# Altium project ESP32_INDUSTRIAL_IO.PrjPcb (part 1 of 2)
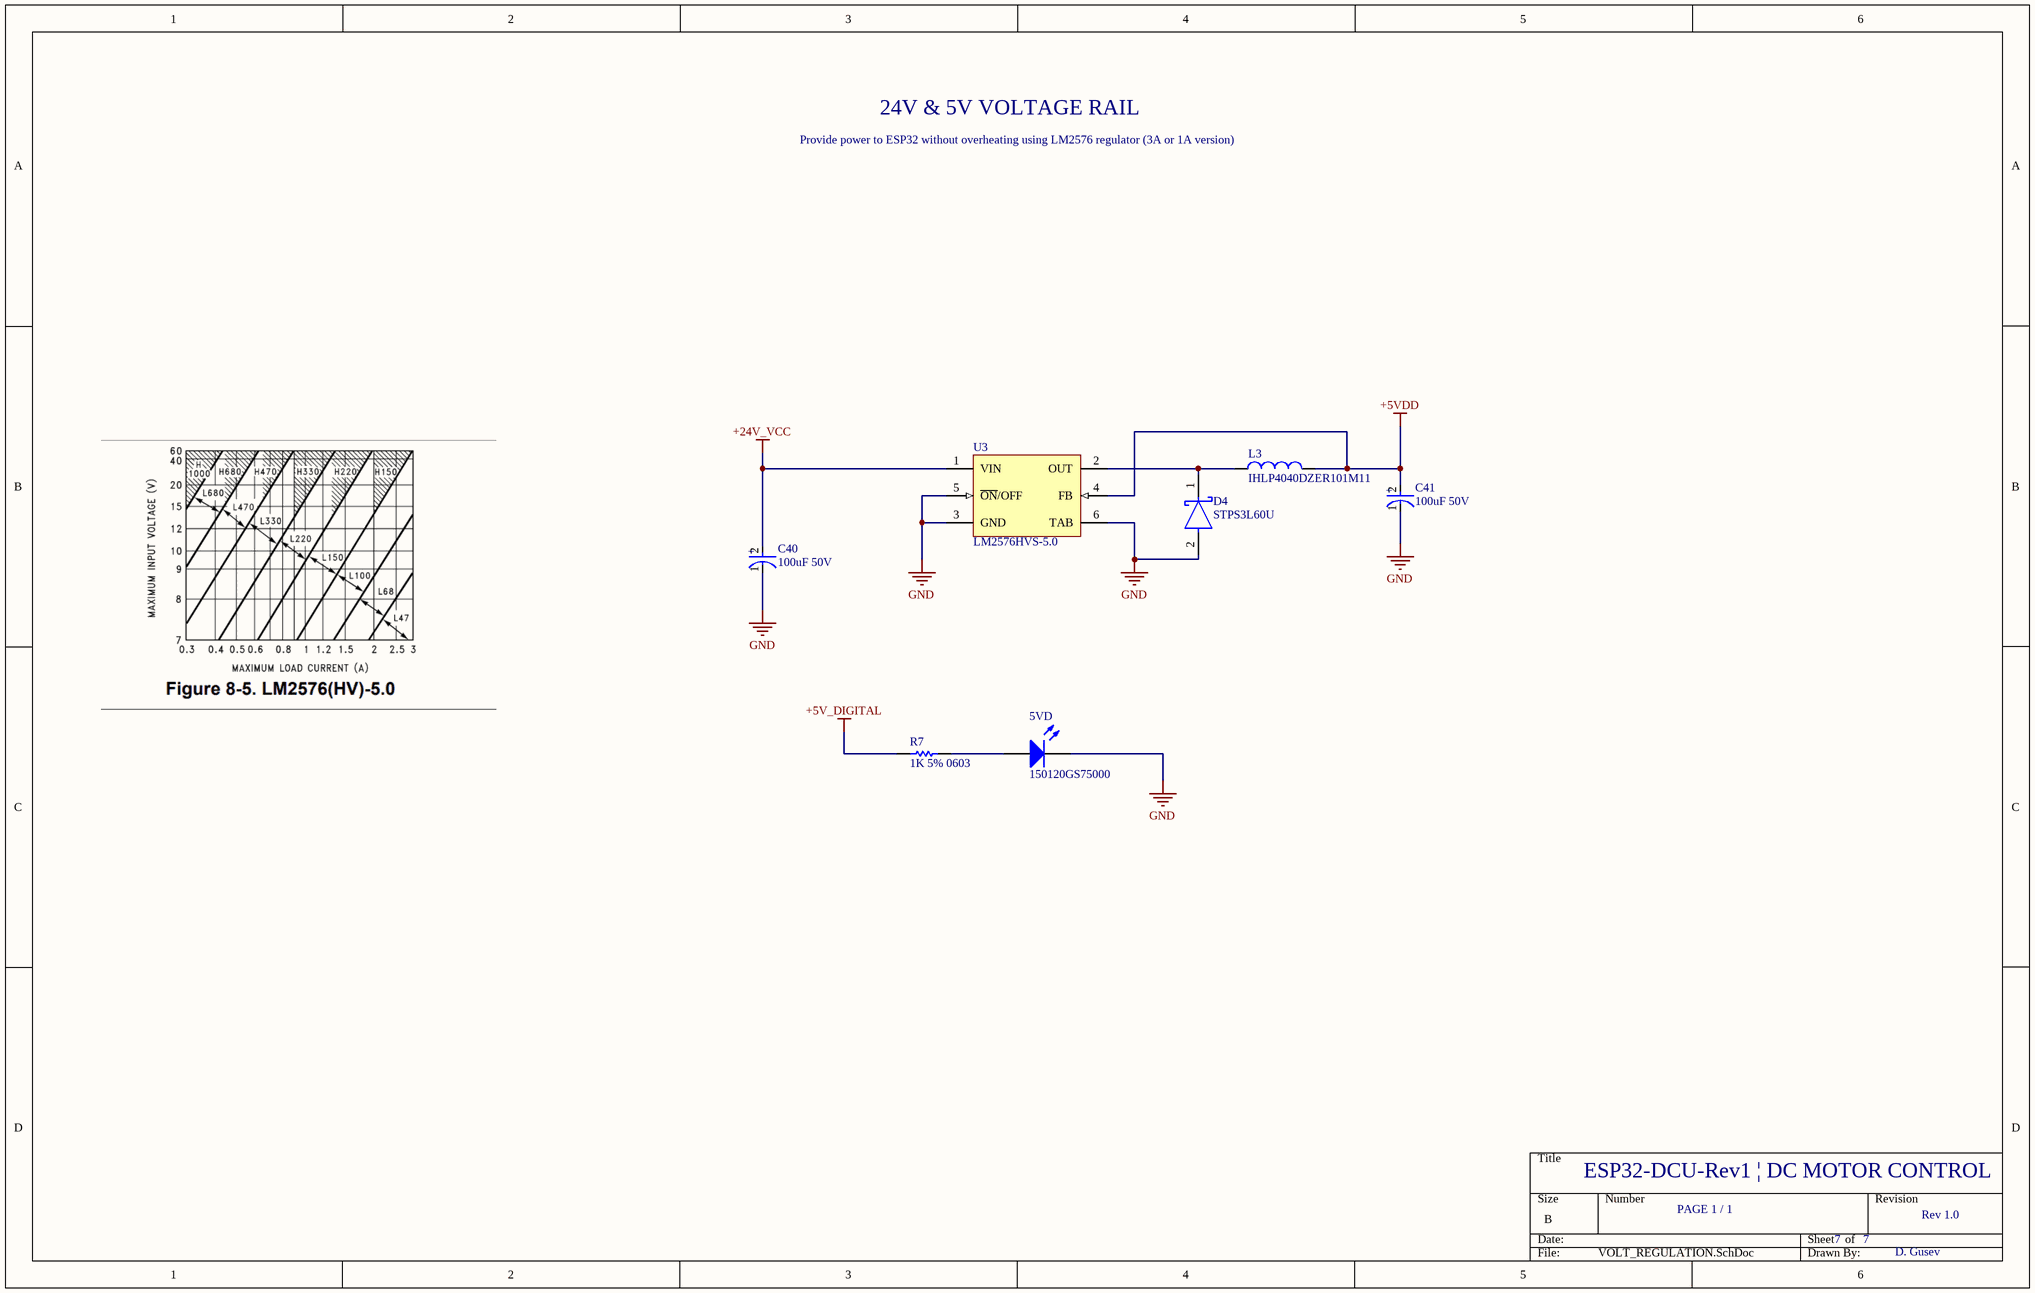
[diagram p0: VOLT_REGULATION.SchDoc]
15 sheets, 209 parts. Net scope: flat (ports and power ports of the same name join across sheets).
Board file: ESP32_INDUSTRIAL_IO.PcbDoc
Sheets:
  VOLT_REGULATION.SchDoc
  USB-ESP32.SchDoc
  ESP32.SchDoc
  LAN9252-1.SchDoc
  LAN9252-2.SchDoc
  EtherCAT.SchDoc
  MCP23017-1.SchDoc
  MCP23017-2.SchDoc
  MCP23017-3.SchDoc
  MCP23017-4.SchDoc
  MCP23017-5.SchDoc
  MCP23017-6.SchDoc
  MCP23017-7.SchDoc
  MCP23017-8.SchDoc
  CONN.SchDoc

## Sheet VOLT_REGULATION.SchDoc
size B

### Parts
(Parts that share a designator on the sheet are numbered #1, #2 ... from top to bottom, then left to right.)
5VD  150120GS75000  [1206_A]
C40  100uF 50V  [FP-EEE-FK1H101P-MFG]
C41  100uF 50V  [FP-EEE-FK1H101P-MFG]
D4  STPS3L60U  [FP-SMB-MFG]
L3  IHLP4040DZER101M11  [VISH-IHLP4040DZER101M11_V]
R7#1  1K 5% 0603  [RESC1608X55X25NL10T15]
U3  LM2576HVS-5.0  [KTT0005B_L]

### Nets
+5V_DIGITAL: R7#1.1
+5VDD: C41.2(A) L3.2 U3.4(FB)
+24V_VCC: C40.2(A) U3.1(VIN)
GND: 5VD.1(K) C40.1(C) C41.1(C) D4.2(A) U3.3(GND) U3.5(~{ON}/OFF) U3.6(TAB)
Net5VD_2: 5VD.2(A) R7#1.2
NetD4_1: D4.1(K) L3.1 U3.2(OUT)

### Notes on the sheet
- Provide power to ESP32 without overheating using LM2576 regulator (3A or 1A version)
- 24V & 5V VOLTAGE RAIL
- ESP32-DCU-Rev1 | DC MOTOR CONTROL
- PAGE 1 / 1
- 7
- Rev 1.0
- D. Gusev
- (in symbol CMP-2000-06208-2) +

### Library data of the parts
5VD = CMP-1426-00014-1: SMD mono-color Chip LED, WL-SMCW, Green; Manufacturer: Wuerth Elektronik; PackageReference: 1206_A; PartNumber: 150120GS75000; ComponentLink1Description: Manufacturer URL; ComponentLink2URL: http://katalog.we-online.com/led/datasheet/150120GS75000.pdf; ComponentLink2Description: Datasheet; Color: Green; ComponentLink1URL: http://www.we-online.com
C40 C41 = CMP-2000-06208-2: CAP ALUM 100UF 20% 50V SMD; Manufacturer Part Number: EEE-FK1H101P; Manufacturer: Panasonic Electronic Components; Automotive Grade: Grade 2; Dissipation Factor: 10%; Life: 2000Hours; Ripple Current: 350mA; Material: Aluminum; Esr: 0.34Ω; Leakage Current: 50uA; Tolerance: 20%; Package: 0; ComponentLink2URL: https://industrial.panasonic.com/cdbs/www-data/pdf/RDE0000/ABA0000C1181.pdf; Temperature Range Low: -55°C; Voltage Rating: 50V; ComponentLink2Description: Datasheet; Category: Cap; Digikey Description: CAP ALUM 100UF 20% 50V SMD; Octopart: https://octopart.com/eeefk1h101p-panasonic-4642841; Automotive: Yes; Temperature: -55°C to +105°C; Capacitance: 100uF; Lead Free: Yes; Mouser Description: Cap Aluminum Lytic 100uF 50V 20% (8 X 10.2mm) SMD 350mA 2000h 105C Automotive T/R; Height: 10.5mm; Device Class L3: Aluminum Electrolytic Capacitors; Value: 100uF; Device Class L1: Passive Components; RoHS: TRUE; Device Class L2: Capacitors; Temperature Range High: +105°C
D4 = CMP-12187-000023-1: DIODE SCHOTTKY 60V 3A SMB; Manufacturer: STMicroelectronics; Standoff Height: 0.05mm; Peak Reverse Current: 150uA; Max Junction Temp: +150°C; Max Surge Forward Current: 100A; Octopart: https://octopart.com/stps3l60u-stmicroelectronics-334329; Category: Diode; Height: 2.65mm; RoHS: TRUE; Mouser Description: Schottky diode Configuration: Single Housing type: DO-214AA=SMB Peak conducting-state current: 100 A; Forward Current: 3A; Manufacturer Part Number: STPS3L60U; Temperature: to +150°C; ComponentLink2URL: https://www.st.com/resource/en/datasheet/stps3l60.pdf; Max Repetitive Reverse Voltage: 60V; Device Class L1: Discrete Semiconductors; Automotive: No; Device Class L3: Schottky Diodes; Digikey Description: DIODE SCHOTTKY 60V 3A SMB; Lead Free: Yes; Temperature Range High: +150°C; Package: SMB; ComponentLink2Description: Datasheet; Device Class L2: Diodes
L3 = CMP-2000-06447-1: Low Profile, High Current IHLP(R) Inductor, 100 uH, +/- 20%, 2.5 A, -55 to 125 degC, 2-Pin SMD, RoHS, Tape and Reel; Manufacturer: Vishay; Qualification: AEC-Q200; Test Frequency: 100kHz; Maximum DC Resistance: 270mOhms; Type: LowProfileHighCurrentIHLPInductor; Inductance: 100uH; Unit Weight: 0.070548oz; Shielding: Shielded; Brand: Vishay/Dale; Maximum DC Current: 2.25A; Termination Style: SMD/SMT; Mounting Style: SMD/SMT; Tolerance: 20%; Factory Pack Quantity: 500; Product Category: FixedInductors; Mounting Technology: SurfaceMount; Manufacturer URL: http://www.vishay.com/; Operating Temperature Range: -55Cto+125C; Datasheet Version: 08/2015; Product: PowerInductors; Packaging: Reel; Length: 10.3mm; Package Description: 2-Pin Surface Mount Device, Body 10.3 x 10.3 mm; Height: 4mm; Width: 10.3mm; Series: IHLP-4040DZ-11; RoHS: True; Package Reference: IHLP4040DZER101M11; Tradename: IHLP; Datasheet URL: http://www.vishay.com/docs/34192/lp40dz11.pdf; Package / Case: 4040
R7#1 = CMP-1659-00009-4: Chip Resistor, 1 KOhm, +/-1%, 0.1 W, -55 to 155 degC, 0603 (1608 Metric), RoHS, Tape and Reel; Manufacturer: Yageo; Voltage Rating: 50 V; ComponentLink2URL: http://www.yageo.com/documents/recent/PYu-RC_Group_51_RoHS_L_04.pdf; Max Operating Temperature: 155 degC; PackageDescription: 2-Pin Surface Mount Device, Body 1.6 x 0.8 mm; Packaging: Tape and Reel; ComponentLink3Description: Package Specification; REACH SVHC: No SVHC; Mount: Surface Mount; ComponentLink2Description: Datasheet; Length: 1.6 mm; PackageReference: 0603; Height: 0.45 mm; DatasheetVersion: Rev. 4, 02/2016; Min Operating Temperature: -55 degC; ComponentLink1Description: Manufacturer URL; Package Quantity: 200; RoHSCompliant: true; ComponentLink3URL: http://www.farnell.com/datasheets/443971.pdf; Pins: 2; Mounting Technology: Surface Mount; ComponentLink1URL: http://www.yageo.com/
U3 = CMP-0069-00141-3: SIMPLE SWITCHER® 3A Step-Down Voltage Regulator, 5-pin TO-263; Manufacturer: Texas Instruments; PackageTopMarking: NSUZXYTTE#*LM2576*HVS-5.0 P+; PowerWise: N; RoHS: N; PackageDescription: TO-263, Molded, .400 x .390 x .180in, 5 Lead, .067in Pitch, Surface Mount; Code_JEDEC: MO-169-AB; CompType: Switcher; ComponentLink1URL: http://www.ti.com/general/docs/lit/getliterature.tsp?genericPartNumber=LM2576HV&fileType=pdf; ComponentLink1Description: Datasheet URL; PinCount: 5; PackageReference: KTT0005B

## Sheet USB-ESP32.SchDoc
size B
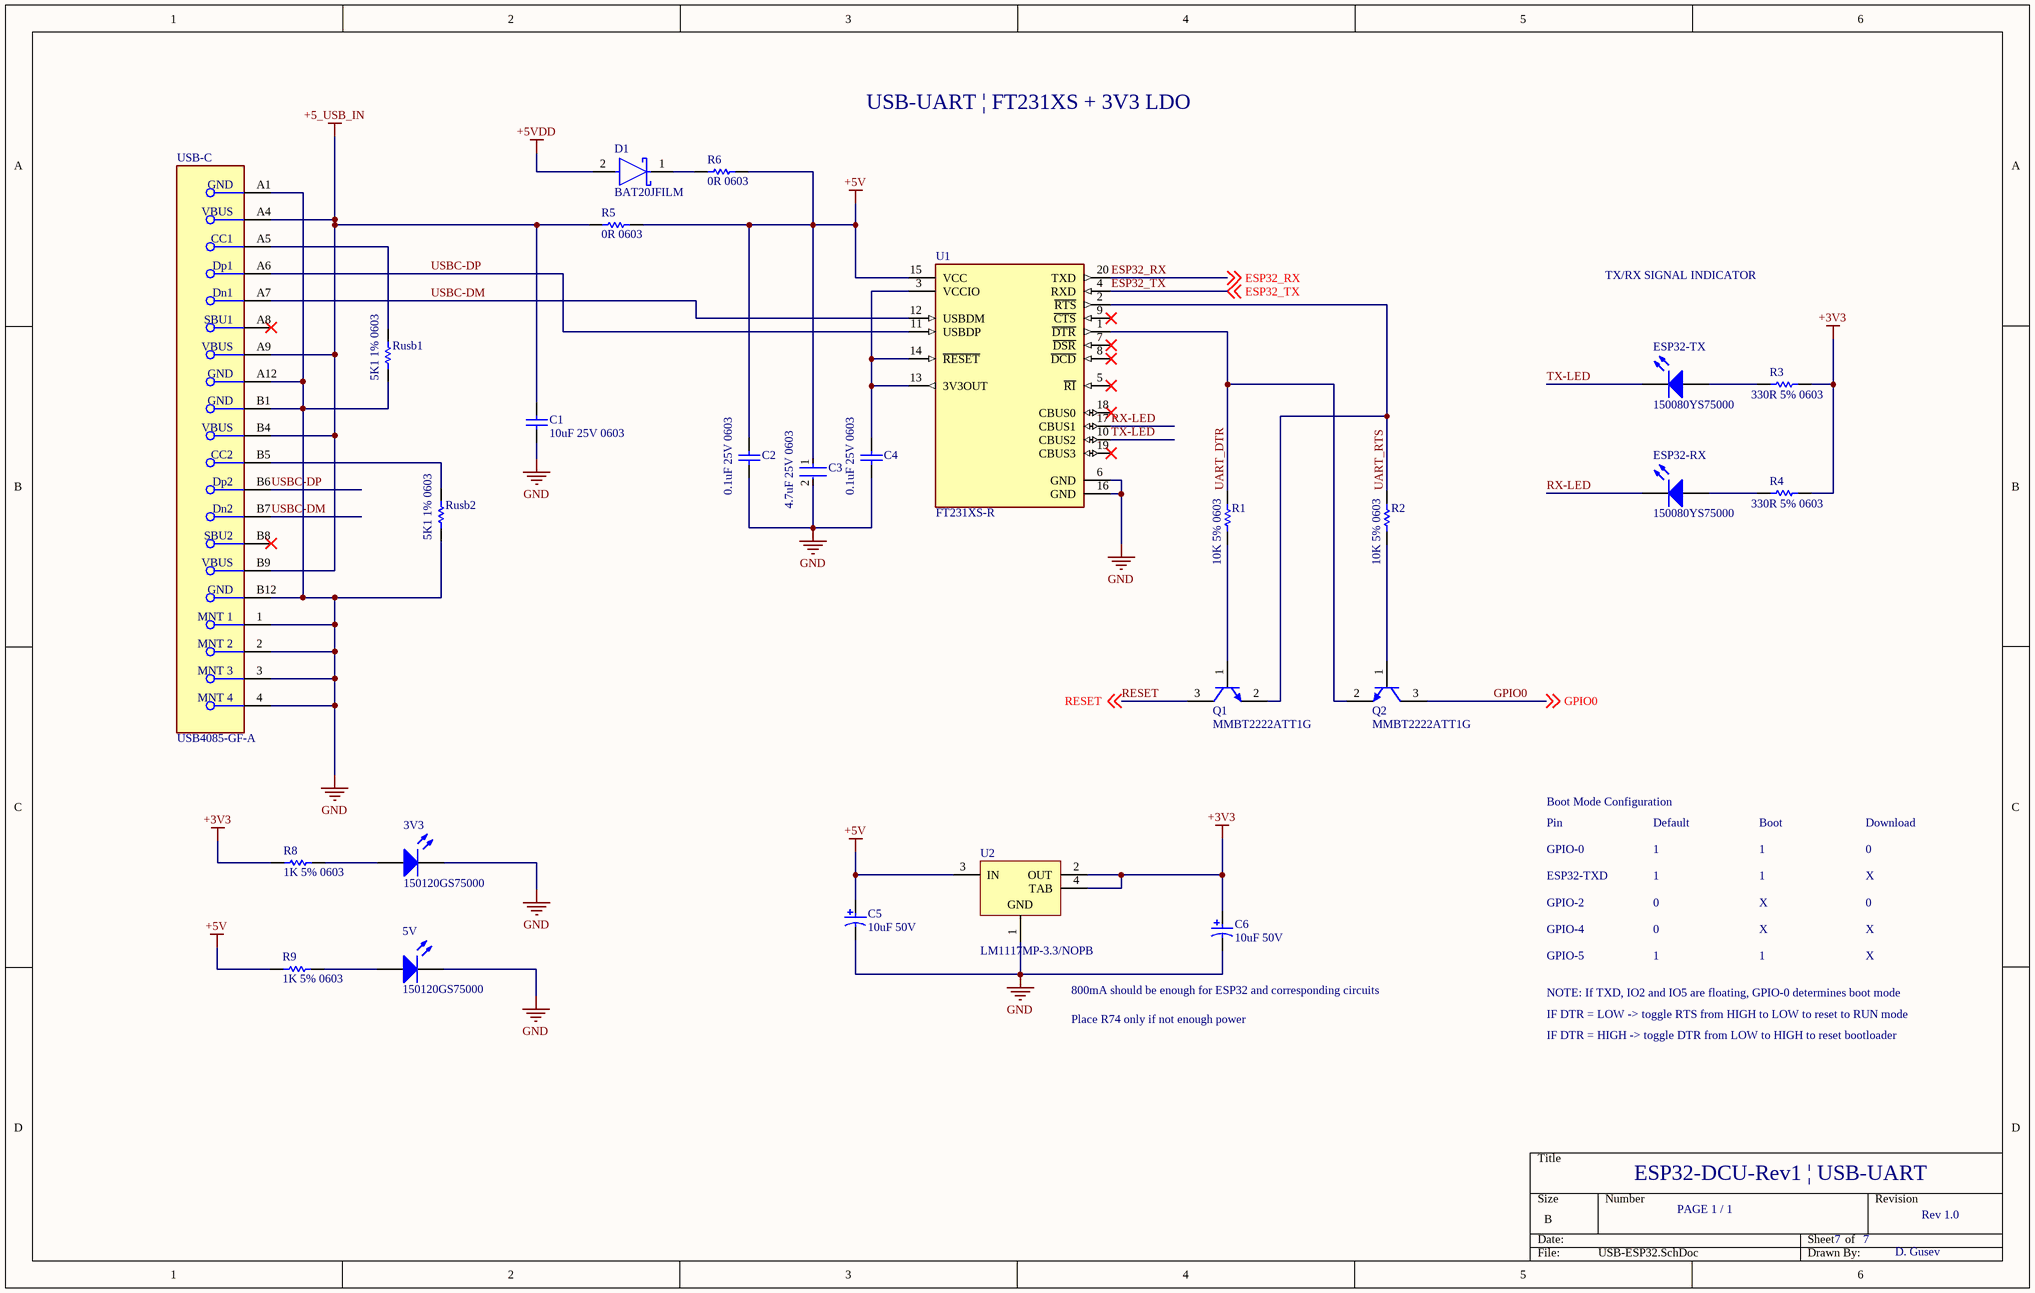
[diagram p1: USB-ESP32.SchDoc]

### Parts
(Parts that share a designator on the sheet are numbered #1, #2 ... from top to bottom, then left to right.)
3V3  150120GS75000  [1206_A]
5V  150120GS75000  [1206_A]
C1  10uF 25V 0603  [CAPC1608X100X20VL10T10]
C2  0.1uF 25V 0603  [CAPC1608X90X35LL10T15]
C3  4.7uF 25V 0603  [FP-GRM188-0_15-IPC_C]
C4  0.1uF 25V 0603  [CAPC1608X90X35LL10T15]
C5  10uF 50V  [PNSC-FK-V-D_V]
C6  10uF 50V  [PNSC-FK-V-D_V]
D1  BAT20JFILM  [FP-BAT20JFILM-MFG]
ESP32-RX  150080YS75000  [0805_A]
ESP32-TX  150080YS75000  [0805_A]
Q1  MMBT2222ATT1G  [ONSC-SC-75-3-463-01_V]
Q2  MMBT2222ATT1G  [ONSC-SC-75-3-463-01_V]
R1  10K 5% 0603  [RESC1608X55X25ML10T15]
R2  10K 5% 0603  [RESC1608X55X25ML10T15]
R3  330R 5% 0603  [RESC1608X55X25NL10T15]
R4  330R 5% 0603  [RESC1608X55X25NL10T15]
R5  0R 0603  [RESC1608X55X25ML10T15]
R6#1  0R 0603  [RESC1608X55X25ML10T15]
R8  1K 5% 0603  [RESC1608X55X25NL10T15]
R9  1K 5% 0603  [RESC1608X55X25NL10T15]
Rusb1  5K1 1% 0603  [RESC1608X55X25ML10T15]
Rusb2  5K1 1% 0603  [RESC1608X55X25ML10T15]
U1  FT231XS-R  [FP-SSOP-20-MFG]
U2  LM1117MP-3.3/NOPB  [DCY0004A_L]
USB-C  USB4085-GF-A  [FP-USB4085-GF-A-MFG]

### Nets
+3V3: C6.1 R3.2 R4.2 R8.1 U2.2(OUT) U2.4(TAB)
+5_USB_IN: C1.2 R5.1 USB-C.A4(VBUS) USB-C.A9(VBUS) USB-C.B4(VBUS) USB-C.B9(VBUS)
+5V: C2.2 C3.1 C5.1 R5.2 R6#1.2 R9.1 U1.15(VCC) U2.3(IN)
+5VDD: D1.2(A)
GND: 3V3.1(K) 5V.1(K) C1.1 C2.1 C3.2 C4.1 C5.2 C6.2 Rusb1.1 Rusb2.1 U1.6(GND) U1.16(GND) U2.1(GND) USB-C.1(MNT_1) USB-C.2(MNT_2) USB-C.3(MNT_3) USB-C.4(MNT_4) USB-C.A1(GND) USB-C.A12(GND) USB-C.B1(GND) USB-C.B12(GND)
ESP32_RX: U1.20(TXD) ; off-sheet ESP32_RX
ESP32_TX: U1.4(RXD) ; off-sheet ESP32_TX
GPIO0: Q2.3(C) ; off-sheet GPIO0
RESET: Q1.3(C) ; off-sheet RESET
RX-LED: ESP32-RX.1(K) U1.17(CBUS1)
TX-LED: ESP32-TX.1(K) U1.10(CBUS2)
UART_DTR: Q2.2(E) R1.2 U1.1(~{DTR})
UART_RTS: Q1.2(E) R2.2 U1.2(~{RTS})
USBC-DM: U1.12(USBDM) USB-C.A7(Dn1) USB-C.B7(Dn2)
USBC-DP: U1.11(USBDP) USB-C.A6(Dp1) USB-C.B6(Dp2)
Net3V3_2: 3V3.2(A) R8.2
Net5V_2: 5V.2(A) R9.2
NetC4_2: C4.2 U1.3(VCCIO) U1.13(3V3OUT) U1.14(~{RESET})
NetD1_1: D1.1(K) R6#1.1
NetESP32-RX_2: ESP32-RX.2(A) R4.1
NetESP32-TX_2: ESP32-TX.2(A) R3.1
NetQ1_1: Q1.1(B) R1.1
NetQ2_1: Q2.1(B) R2.1
NetRusb1_2: Rusb1.2 USB-C.A5(CC1)
NetRusb2_2: Rusb2.2 USB-C.B5(CC2)

Not connected (* = marked no-connect by the designer): U1 5(~{RI})* 7(~{DSR})* 8(~{DCD})* 9(~{CTS})* 18(CBUS0)* 19(CBUS3)*; USB-C A8(SBU1)* B8(SBU2)*

### Notes on the sheet
- USB-UART | FT231XS + 3V3 LDO
- TX/RX SIGNAL INDICATOR
- Boot Mode Configuration
- Pin
- Default
- Boot
- Download
- GPIO-0
- ESP32-TXD
- GPIO-2
- 1
- 0
- X
- GPIO-4
- GPIO-5
- 800mA should be enough for ESP32 and corresponding circuits
- Place R74 only if not enough power
- NOTE: If TXD, IO2 and IO5 are floating, GPIO-0 determines boot mode
- IF DTR = LOW -> toggle RTS from HIGH to LOW to reset to RUN mode
- IF DTR = HIGH -> toggle DTR from LOW to HIGH to reset bootloader
- ESP32-DCU-Rev1 | USB-UART
- PAGE 1 / 1
- 7
- Rev 1.0
- D. Gusev

### Library data of the parts
3V3 5V = CMP-1426-00014-1: as 5VD on sheet VOLT_REGULATION; PackageReference: 1206_A; PartNumber: 150120GS75000; ComponentLink1Description: Manufacturer URL; ComponentLink2URL: http://katalog.we-online.com/led/datasheet/150120GS75000.pdf; ComponentLink2Description: Datasheet; Color: Green; ComponentLink1URL: http://www.we-online.com
C1 = CMP-2000-05442-1: Chip Capacitor, 10 uF, +/- 20%, 25 V, -55 to 85 degC, 0603 (1608 Metric), RoHS, Tape and Reel; Manufacturer: TDK; PCN Part Number: MLCCPartNumberChange30/Nov/2012; Other Names: 445-9015-1; Capacitance: 10µF; Design Resources: 20WNon-IsolatedBuckLEDDriverUsingPLLNK460KG; Kits: 445-9014-KIT-ND-KITMLCC100PF-22UF060310-50V; Product Training Modules: SEAT,CCV,andTVCLDesignToolsGuidetoReplacinganElectrolyticCapacitorwithanMLCC; Online Catalog: CSeries,GeneralPurpose; Temperature Coefficient: X5R; Package Description: 2-Pin Surface Mount Device, Body 1.6 x 0.8 mm; Lead Style: -; Datasheet URL: http://download.siliconexpert.com/pdfs/2016/2/22/9/40/35/949/tdk_/manual/8010476609961980104703407078c1608x5r1e106m080ac.pdf.pdf; Category: Capacitors; Package / Case: 0603(1608Metric); Packaging: CutTape(CT); Series: C; Features: -; Family: CeramicCapacitors; Standard Package: 1; Tolerance: ±20%; Operating Temperature: -55degC~85degC; Mounting Type: SurfaceMount,MLCC; Ratings: -; Size / Dimension: 0.063"Lx0.031"W(1.60mmx0.80mm); Applications: GeneralPurpose; Package Reference: 1608; RoHS Information: RoHSCertificate-MLCC; Manufacturer URL: http://www.tdk.com/; Datasheet Version: Feb-16; Voltage - Rated: 25V; Height - Seated (Max): -; Thickness (Max): 0.039"(1.00mm); Lead Spacing: -
C2 C4 = CMP-2006-02868-1: Part Number: GRM188R71E104KA01D; Manufacturer: Murata
C3 = CMP-2006-02523-2: Chip Multilayer Ceramic Capacitors for General Purpose, 0603, 4.7uF, X5R, 15%, 10%, 25V; Case Code (Metric): 1608; Max Operating Temperature: 85°C; REACH SVHC: No SVHC; Voltage Rating: 25V; Dielectric: X5R; Packaging: Cut Tape; Width: 0.031inch; Min Operating Temperature: -55°C; Lead Free: Lead Free; Capacitance: 4.7uF; Height: 0.8mm; Case Code (Imperial): 0603; Length: 1.6mm; Voltage Rating (DC): 25V; Case/Package: 0603; Voltage: 25V; Tolerance: 10%; Thickness: 0.031inch; Mount: Surface Mount; Material: Ceramic; Package Quantity: 4000; Depth: 0.8mm
C5 C6 = CMP-2000-06207-1: Aluminum Electrolytic Capacitor, 10 uF, +/- 20%, 50 V, 2-Pin SMD (Size Code D), -55 to 105 degC, RoHS, Tape and Reel; Manufacturer: Panasonic; Lifetime@Temperature: 2000Hrs@105°C; Type: Can; Ripple Current: 165mA; Impedance: 0.88O; Capacitance: 10µF; Manufacturer URL: http://www.panasonic.com/; Mounting Technology: SurfaceMount; Rated Voltage: 50V; Datasheet URL: http://industrial.panasonic.com/cdbs/www-data/pdf/RDE0000/ABA0000C1181.pdf; Package Reference: FK-V-D; Series: FK; Operating Temp Range: -55to+105°C; Operating Temp-Max: 105°C; Datasheet Version: 03/2016; Package URL: http://industrial.panasonic.com/cdbs/www-data/pdf/RDE0000/DME0000COL48.pdf; Case Size/Dimension: Ø6.3x5.8mm; Package Description: 2-Pin Electrolytic Aluminum Capacitor, Body 6.6 x 6.6 mm
D1 = CMP-12187-000030-1: DIODE SCHOTTKY 23V 1A SOD323; Polarity: Standard; Element Configuration: Single; Capacitance: 30pF; Forward Voltage: 620mV; Max Surge Current: 5A; Peak Reverse Current: 12uA; Packaging: Tape and Reel; Weight: 0.01lb; Output Current: 1A; Lead Free: Lead Free; Forward Current: 1A; Mount: Surface Mount; Max Reverse Voltage (DC): 23V; Average Rectified Current: 1A; Max Operating Temperature: 150°C; Max Forward Surge Current (Ifsm): 5A; REACH SVHC: No SVHC; Current Rating: 1A; Length: 1.8mm; Radiation Hardening: No; Max Reverse Leakage Current: 12uA; Voltage Rating (DC): 23V; Height: 1.03mm; Peak Non-Repetitive Surge Current: 5A; Max Repetitive Reverse Voltage (Vrrm): 23V; Min Operating Temperature: -65°C; Number of Pins: 2; Width: 1.35mm; Package Quantity: 1
ESP32-RX ESP32-TX = CMP-1426-00012-1: SMD mono-color Chip LED, WL-SMCW, Yellow; Manufacturer: Wuerth Elektronik; Color: Yellow; ComponentLink1URL: http://www.we-online.com; PackageReference: 0805_A; ComponentLink2URL: http://katalog.we-online.com/led/datasheet/150080YS75000.pdf; ComponentLink1Description: Manufacturer URL; ComponentLink2Description: Datasheet; PartNumber: 150080YS75000
Q1 Q2 = CMP-1048-00417-1: General Purpose Transistor, NPN Silicon, 3-Pin SC-75, Pb-Free, Tape and Reel; Manufacturer: On Semiconductor; IC Continuous (A): 0.6; fT Min (MHz): 300; DatasheetVersion: Rev. 5; PackageVersion: Rev. F, 07/2005; ComponentLink1Description: Manufacturer URL; RoHS: TRUE; Packing: Tape and Reel; ComponentLink3URL: http://www.onsemi.com/pub_link/Collateral/463-01.PDF; ComponentLink1URL: http://www.onsemi.com/; ComponentLink3Description: Package Specification; ComponentLink2URL: http://www.onsemi.cn/pub_link/Collateral/MMBT2222ATT1-D.PDF; Mounting Technology: Surface Mount; PartNumber: MMBT2222ATT1G; ComponentLink2Description: Datasheet; Polarity: NPN; PackageReference: SC-75-3-463-01; PackageDescription: 3-Pin Small Outline Transistor, Body 1.6 x 0.8 mm, Pitch 0.5 mm
R1 R2 = CMP-2100-03664-1: Chip Resistor, 10 KOhm, +/- 1%, 01 W, -55 to 155 degC, 0603 (1608 Metric), RoHS, Tape and Reel; Manufacturer: Yageo; Temperature Coefficient: 100ppm/degreesC; Resistance: 10KOhm; Voltage Rating: 75V; Power Rating: 100mW; Voltage Rating (DC): 50V; Composition: ThickFilm; RoHSCompliant: true; Height: 0.45mm; Lead Free: LeadFree; Case Code (Metric): 1608; Case/Package: 0603; Datasheet Version: Rev. 5, 10/2016; Package Reference: 0603; Depth: 0.8mm; Package Description: 2-Pin Surface Mount Device, Body 1.6 x 0.8 mm; Case Code (Imperial): 0603; Packaging: TapeandReel; Termination: SMD/SMT; Lead Pitch: 0.3mm; Width: 0.8mm; Number of Pins: 2; Length: 1.6mm; REACH SVHC: NoSVHC; Military Standard: Not; Max Operating Temperature: 155degC; Min Operating Temperature: -55degC; Manufacturer URL: http://www.yageo.com/; Datasheet URL: http://www.yageo.com/NewPortal/yageodocoutput?fileName=/pdf/R-Chip/PYu-RC_Group_51_RoHS_L_5.pdf; Weight: 7.1E-05oz; Tolerance: 1%
R3 R4 = CMP-1659-00020-2: Chip Resistor, 330 Ohm, +/- 1%, 0.1 W, -55 to 155 degC, 0603 (1608 Metric), RoHS, Tape and Reel; Tolerance: 10%; ESR: 800 mohm; Voltage Rating (DC): 16 V; Capacitance: 47 uF; Length: 7.3 mm; ComponentLink1URL: http://www.yageo.com/; Packaging: Tape and Reel; Pins: 2; ComponentLink1Description: Manufacturer URL; Case Code (Imperial): 2917; REACH SVHC: No SVHC; Width: 4.3 mm; ComponentLink2Description: Datasheet; Voltage Rating: 16 V; RoHSCompliant: True; Max Operating Temperature: 125degC; ComponentLink2URL: http://www.yageo.com/documents/recent/PYu-RC_Group_51_RoHS_L_04.pdf; Min Operating Temperature: -55degC; Case/Package: 2917; Radiation Hardening: No; DatasheetVersion: Rev. 4, 02/2016; Mount: Surface Mount; PackageReference: 0603; Package Quantity: 500; Case Code (Metric): 7343; PackageDescription: 2-Pin Surface Mount Device, Body 1.6 x 0.8 mm; Height: 3.1 mm
R5 R6#1 = CMP-2100-03667-1: Chip Resistor, 0 Ohm, +/- 5%, 0.1 W, -55 to 155 degC, 0603 (1608 Metric), RoHS, Tape and Reel; Manufacturer: Yageo; Temperature Coefficient: 200ppm/degreesC; Voltage Rating: 50V; Power Rating: 100mW; Resistance: 0mOhm; Width: 0.8mm; Max Operating Temperature: 155degC; Tolerance: 5%; Package Reference: 0603; Height: 0.45mm; Depth: 0.8mm; Package Description: 2-Pin Surface Mount Device, Body 1.6 x 0.8 mm; Termination: SMD/SMT; Package Quantity: 5000; Case/Package: 0603; Case Code (Imperial): 0603; Radiation Hardening: No; Number of Pins: 2; Length: 1.6mm; Lead Free: LeadFree; Voltage Rating (DC): 50V; Military Standard: Not; Datasheet URL: http://www.yageo.com/NewPortal/yageodocoutput?fileName=/pdf/R-Chip/PYu-RC_Group_51_RoHS_L_5.pdf; Manufacturer URL: http://www.yageo.com/; Packaging: TapeandReel; Case Code (Metric): 1608; Min Operating Temperature: -55degC; Composition: ThickFilm; RoHSCompliant: true; Contact Plating: Tin; Datasheet Version: Rev. 5, 10/2016; REACH SVHC: NoSVHC
R8 R9 = CMP-1659-00009-4: as R7#1 on sheet VOLT_REGULATION; ComponentLink2URL: http://www.yageo.com/documents/recent/PYu-RC_Group_51_RoHS_L_04.pdf; Max Operating Temperature: 155 degC; PackageDescription: 2-Pin Surface Mount Device, Body 1.6 x 0.8 mm; Packaging: Tape and Reel; ComponentLink3Description: Package Specification; REACH SVHC: No SVHC; Mount: Surface Mount; ComponentLink2Description: Datasheet; Length: 1.6 mm; PackageReference: 0603; Height: 0.45 mm; DatasheetVersion: Rev. 4, 02/2016; Min Operating Temperature: -55 degC; ComponentLink1Description: Manufacturer URL; Package Quantity: 200; RoHSCompliant: true; ComponentLink3URL: http://www.farnell.com/datasheets/443971.pdf; Pins: 2; Mounting Technology: Surface Mount; ComponentLink1URL: http://www.yageo.com/
Rusb1 Rusb2 = CMP-2000-04091-1: Manufacturer: Yageo; Part Number: RC0603FR-075K1L
U1 = CMP-0248-00024-3: IC USB SERIAL FULL UART 20SSOP; Operating Supply Voltage: 5V; Operating Supply Current: 8mA; Number of Channels: 1; Min Supply Voltage: 2.97V; Max Supply Voltage: 5.5V; Data Rate: 12Mbps; Height: 0.059inch; Packaging: Tape and Reel; Mount: Surface Mount; Package Quantity: 2000; Radiation Hardening: No; Case/Package: SSOP; Min Operating Temperature: -40°C; Width: 0.157inch; Number of Pins: 20; Weight: 0.016oz; Interface: UART; Max Operating Temperature: 85°C; Length: 8.74mm
U2 = CMP-0062-01638-4: 800mA Low-Dropout Linear Regulator, 4-pin SOT-223, Pb-Free; Manufacturer: Texas Instruments; CompType: LDO IC; PackageTopMarking: XYTT*N05A; High-Reliability: Y; PowerWise: N; ComponentLink1URL: http://www.ti.com/general/docs/lit/getliterature.tsp?genericPartNumber=LM1117-N&fileType=pdf; PinCount: 4; PackageDescription: Molded SOT-223, 6.50 x 3.56 x 1.6mm Body, 4 Lead, 2.3mm Pitch; Code_IPC: SOT223-4; PartNumber: LM1117MP-3.3/NOPB; Code_JEDEC: TO-261-AA; RoHS: Y; PackageReference: DCY0004A; ComponentLink1Description: Datasheet URL
USB-C = CMP-196119-000001-1: CONN RCPT USB2.0 TYPEC 16POS; Manufacturer: Global Connector Technology; Voltage Rating: 20V; Conn Orientation: Right Angle; Shielding: true; Current Rating: 4.25A; Number Of Contacts: 16; Pitch: 0.85mm; Is Female: yes; ComponentLink2URL: https://gct.co/files/drawings/usb4085.pdf; Category: Conn; Automotive: No; ComponentLink2Description: Datasheet; Height: 3.66mm; Manufacturer Part Number: USB4085-GF-A; Package: 0; Usb Standard: USB 2.0; Octopart: https://octopart.com/usb4085-gf-a-global+connector+technology-94773699; Device Class L3: unset; Digikey Description: CONN RCPT USB2.0 TYPEC 16POS; Temperature Range Low: -40°C; Temperature: -40°C to +85°C; Lead Free: Yes; Contact Material: Gold,Nickel; Device Class L1: Connectors; Temperature Range High: +85°C; Device Class L2: USB Connectors; RoHS: TRUE

## Sheet ESP32.SchDoc
size B
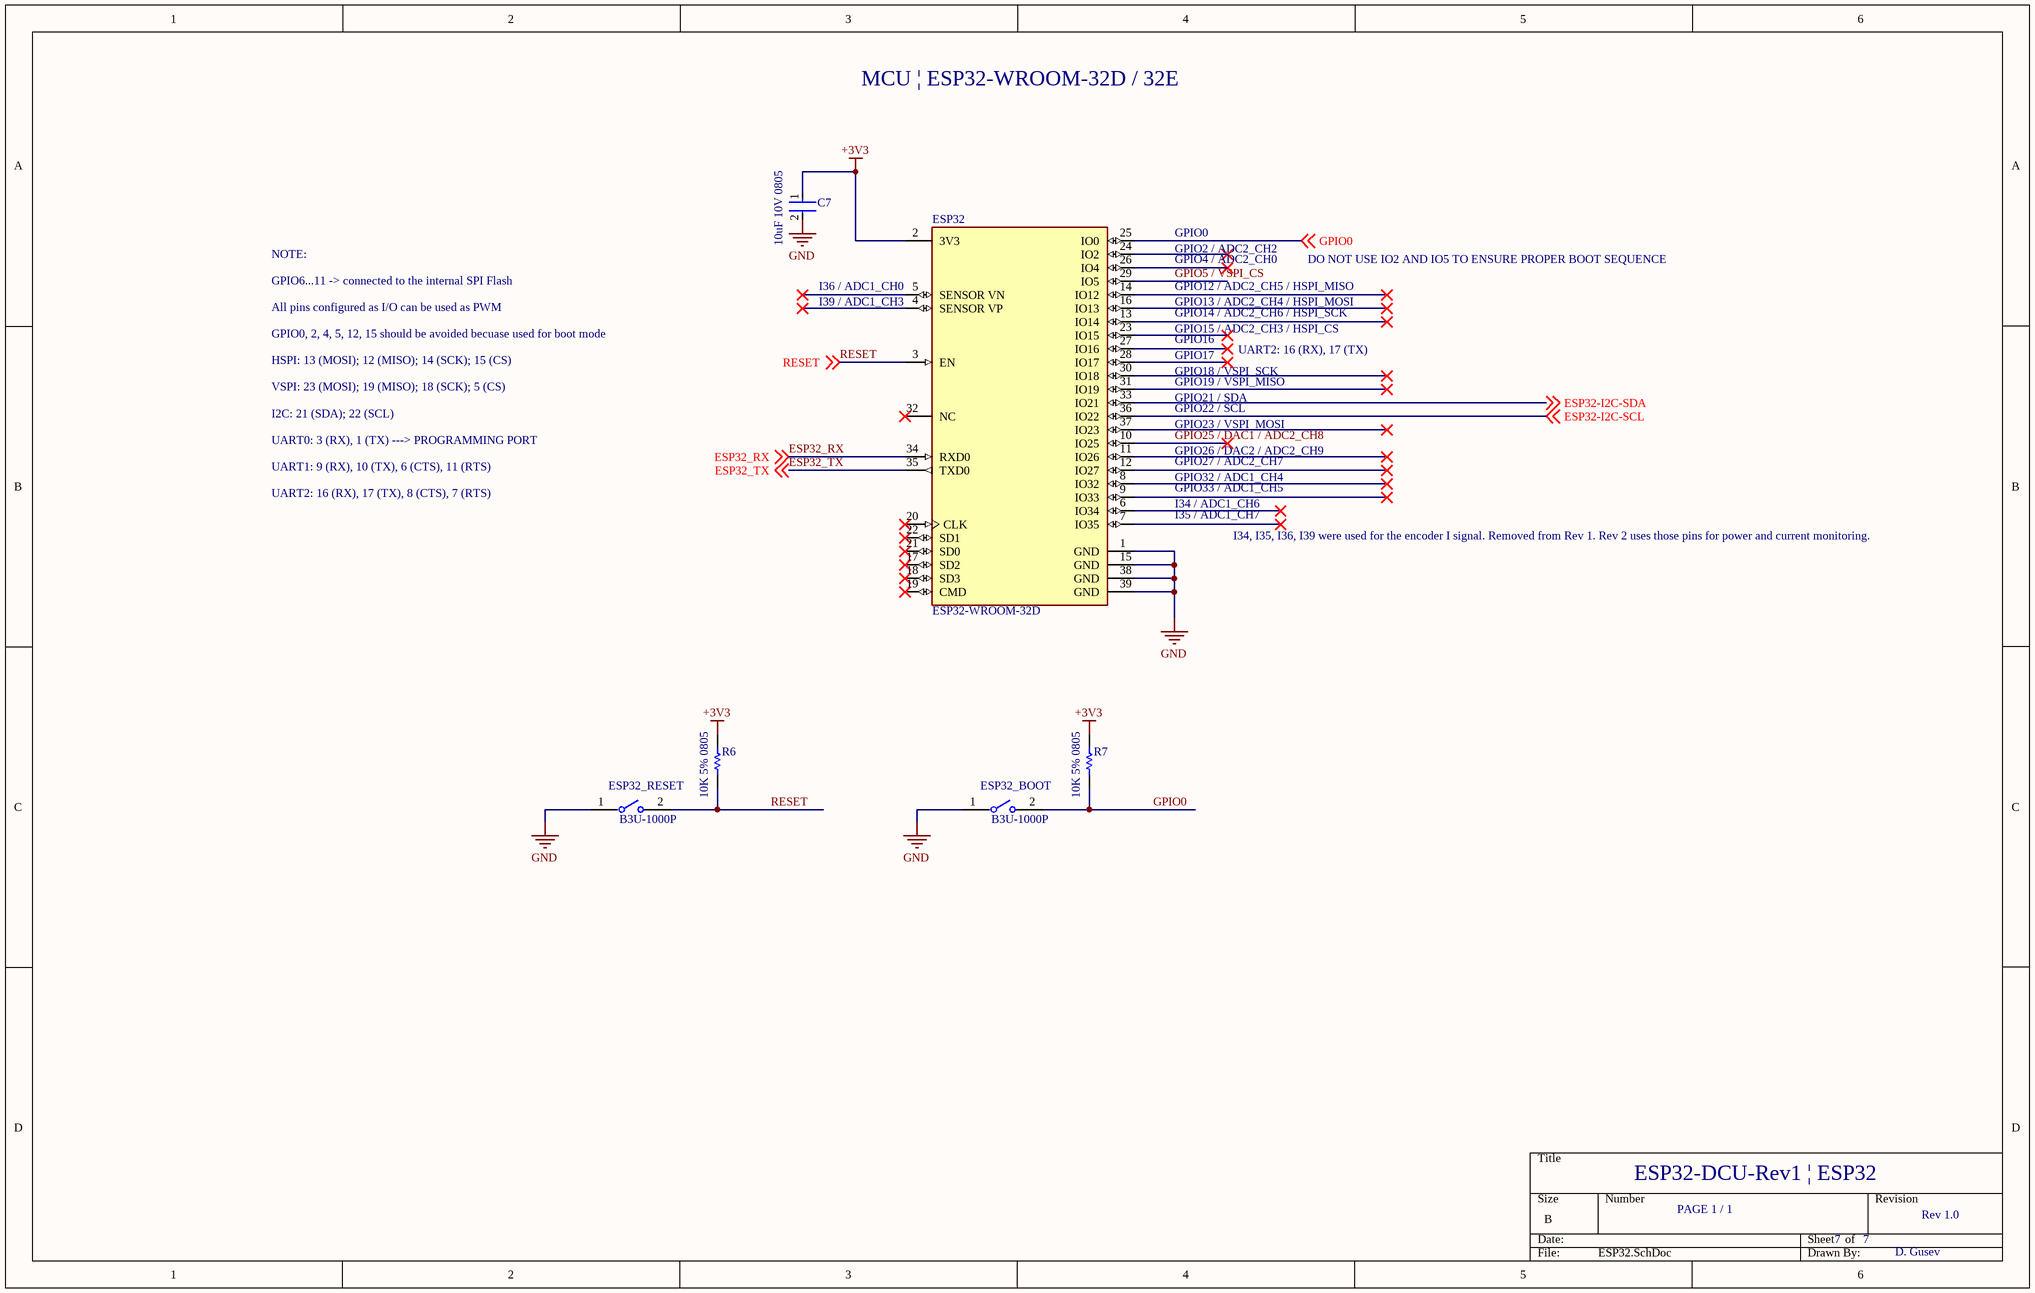
[diagram p2: ESP32.SchDoc]

### Parts
(Parts that share a designator on the sheet are numbered #1, #2 ... from top to bottom, then left to right.)
C7  10uF 10V 0805  [FP-C0805C-DG-MFG]
ESP32  ESP32-WROOM-32D  [FP-ESP32-WROOM-32D-MFG]
ESP32_BOOT  B3U-1000P  [FP-B3U-1000P-MFG]
ESP32_RESET  B3U-1000P  [FP-B3U-1000P-MFG]
R6#2  10K 5% 0805  [RESC2013X60X40ML20T25]
R7#2  10K 5% 0805  [RESC2013X60X40ML20T25]

### Nets
+3V3: C7.1 ESP32.2(3V3) R6#2.2 R7#2.2
GND: C7.2 ESP32.1(GND) ESP32.15(GND) ESP32.38(GND) ESP32.39(GND) ESP32_BOOT.1 ESP32_RESET.1
ESP32-I2C-SCL: ESP32.36(IO22) ; off-sheet ESP32-I2C-SCL
ESP32-I2C-SDA: ESP32.33(IO21) ; off-sheet ESP32-I2C-SDA
ESP32_RX: ESP32.34(RXD0) ; off-sheet ESP32_RX
ESP32_TX: ESP32.35(TXD0) ; off-sheet ESP32_TX
GPIO0: ESP32.25(IO0) ESP32_BOOT.2 R7#2.1 ; off-sheet GPIO0
GPIO5 / VSPI_CS: ESP32.29(IO5)
GPIO25 / DAC1 / ADC2_CH8: ESP32.10(IO25)
RESET: ESP32.3(EN) ESP32_RESET.2 R6#2.1 ; off-sheet RESET

Not connected (* = marked no-connect by the designer): ESP32 4(SENSOR_VP)* 5(SENSOR_VN)* 6(IO34)* 7(IO35)* 8(IO32)* 9(IO33)* 11(IO26)* 12(IO27)* 13(IO14)* 14(IO12)* 16(IO13)* 17(SD2)* 18(SD3)* 19(CMD)* 20(CLK)* 21(SD0)* 22(SD1)* 23(IO15)* 24(IO2)* 26(IO4)* 27(IO16)* 28(IO17)* 30(IO18)* 31(IO19)* 32(NC)* 37(IO23)*

### Notes on the sheet
- MCU | ESP32-WROOM-32D / 32E
- GPIO0
- NOTE:
- GPIO6...11 -> connected to the internal SPI Flash
- (near ESP32) I36 / ADC1_CH0
- GPIO2 / ADC2_CH2
- GPIO4 / ADC2_CH0
- GPIO12 / ADC2_CH5 / HSPI_MISO
- DO NOT USE IO2 AND IO5 TO ENSURE PROPER BOOT SEQUENCE
- All pins configured as I/O can be used as PWM
- GPIO0, 2, 4, 5, 12, 15 should be avoided becuase used for boot mode
- HSPI: 13 (MOSI); 12 (MISO); 14 (SCK); 15 (CS)
- (near ESP32) I39 / ADC1_CH3
- GPIO13 / ADC2_CH4 / HSPI_MOSI
- GPIO14 / ADC2_CH6 / HSPI_SCK
- GPIO15 / ADC2_CH3 / HSPI_CS
- GPIO16
- GPIO17
- UART2: 16 (RX), 17 (TX)
- VSPI: 23 (MOSI); 19 (MISO); 18 (SCK); 5 (CS)
- I2C: 21 (SDA); 22 (SCL)
- GPIO18 / VSPI_SCK
- GPIO19 / VSPI_MISO
- GPIO21 / SDA
- GPIO22 / SCL
- GPIO23 / VSPI_MOSI
- UART0: 3 (RX), 1 (TX) ---> PROGRAMMING PORT
- UART1: 9 (RX), 10 (TX), 6 (CTS), 11 (RTS)
- UART2: 16 (RX), 17 (TX), 8 (CTS), 7 (RTS)
- GPIO26 / DAC2 / ADC2_CH9
- GPIO27 / ADC2_CH7
- GPIO32 / ADC1_CH4
- GPIO33 / ADC1_CH5
- I34 / ADC1_CH6
- I35 / ADC1_CH7
- I34, I35, I36, I39 were used for the encoder I signal. Removed from Rev 1. Rev 2 uses those pins for power and current monitoring.
- ESP32-DCU-Rev1 | ESP32
- PAGE 1 / 1
- 7
- Rev 1.0
- D. Gusev

### Library data of the parts
C7 = CMP-2007-03243-2: CAP CER 10UF 10V X5R 0805; Manufacturer Part Number: C0805C106K8PACTU; Manufacturer: Kemet; 3DS Part Number: 220-00001; Tolerance: 10%; Temperature Coefficient: 15%; Material: Ceramic; Device Class L2: Capacitors; Device Class L1: Passive Components; ComponentLink2URL: https://content.kemet.com/datasheets/KEM_C1006_X5R_SMD.pdf; Height: 1.4mm; Lead Free: Yes; Digikey Description: CAP CER 10UF 10V X5R 0805; Octopart: https://octopart.com/c0805c106k8pactu-kemet-98697; Capacitance: 10uF; Value: 10uF; Temperature Range Low: -55°C; Temperature: -55°C to +85°C; Automotive: No; Mouser Description: CAP CER 10UF 10V X5R 0805; Ipc Land Pattern Name: CAPC200125X125; Temperature Range High: +85°C; Voltage: 10V; RoHS: TRUE; Device Class L3: Ceramic Capacitors; ComponentLink2Description: Datasheet; Voltage Rating: 10V; Package: C0805C-DG; Temperature Characteristic: X5R; Category: Cap
ESP32 = CMP-194065-000003-1: WIFI MODULE 32MBITS SPI FLASH; Manufacturer: Espressif Systems; Max Supply Voltage: 3.6V; Nominal Supply Current: 500mA; Max Frequency: 2484MHz; Number Of Adc Channels: 16; Number Of Gpio: 32; Interface: I2C,SPI,UART,Ethernet,I2S,Other; Data Rate: 150Mbits/s; Min Supply Voltage: 3V; Bandwidth: 72MHz; Sensitivity: -98dBm; Octopart: https://octopart.com/esp32-wroom-32d-espressif+systems-91040050; Package: ESP32-WROOM-32D; ComponentLink2URL: https://www.espressif.com/sites/default/files/documentation/esp32-wroom-32d_esp32-wroom-32u_datasheet_en.pdf; Lead Free: Yes; Category: UNK; Mouser Description: Wi-Fi/BT BLE Module ESP32-D0WD, SPI Flash, UART, P; Device Class L1: Integrated Circuits (ICs); RoHS: TRUE; Temperature Range Low: -40°C; ComponentLink2Description: Datasheet; Digikey Description: WIFI MODULE 32MBITS SPI FLASH; Height: 3.2mm; Temperature: -40°C to +85°C; Manufacturer Part Number: ESP32-WROOM-32D; Device Class L3: Transceivers; Device Class L2: RF Semiconductors and Devices; Temperature Range High: +85°C; Automotive: No
ESP32_BOOT ESP32_RESET = CMP-2100-03586-2: SWITCH TACTILE SPST-NO 0.05A 12V; Contact Resistance: 100mR; Operating Force: 1.5N; Max Current Rating: 50mA; Switch Travel: 0.15mm; Actuator Type: Standard; Mechanical Life: 200000Cycles; Ratings: Dust Proof; Illumination Type: Non-Illuminated; Throw Configuration: SPST; Actuator Length: 0.4mm; Switch Function: Off-Mom; Height: 1.2mm; Width: 3mm; Weight: 0.000776oz; Contact Material: Silver; Max Voltage Rating (DC): 12V; Insulation Resistance: 100MR; Lead Free: Lead Free; Current Rating: 50mA; Termination: SMD/SMT; Length: 4mm; Voltage Rating (DC): 12V; Contact Current Rating: 50mA; Orientation: Straight; Depth: 2.5mm; Max Operating Temperature: 70°C; Packaging: Tape and Reel; Min Operating Temperature: -25°C; Package Quantity: 1; Mount: Surface Mount; Electrical Life: 200000Cycles
R6#2 R7#2 = CMP-2001-00590-1: Part Number: ERA6AEB123V; Manufacturer: Panasonic

## Sheet LAN9252-1.SchDoc
size B
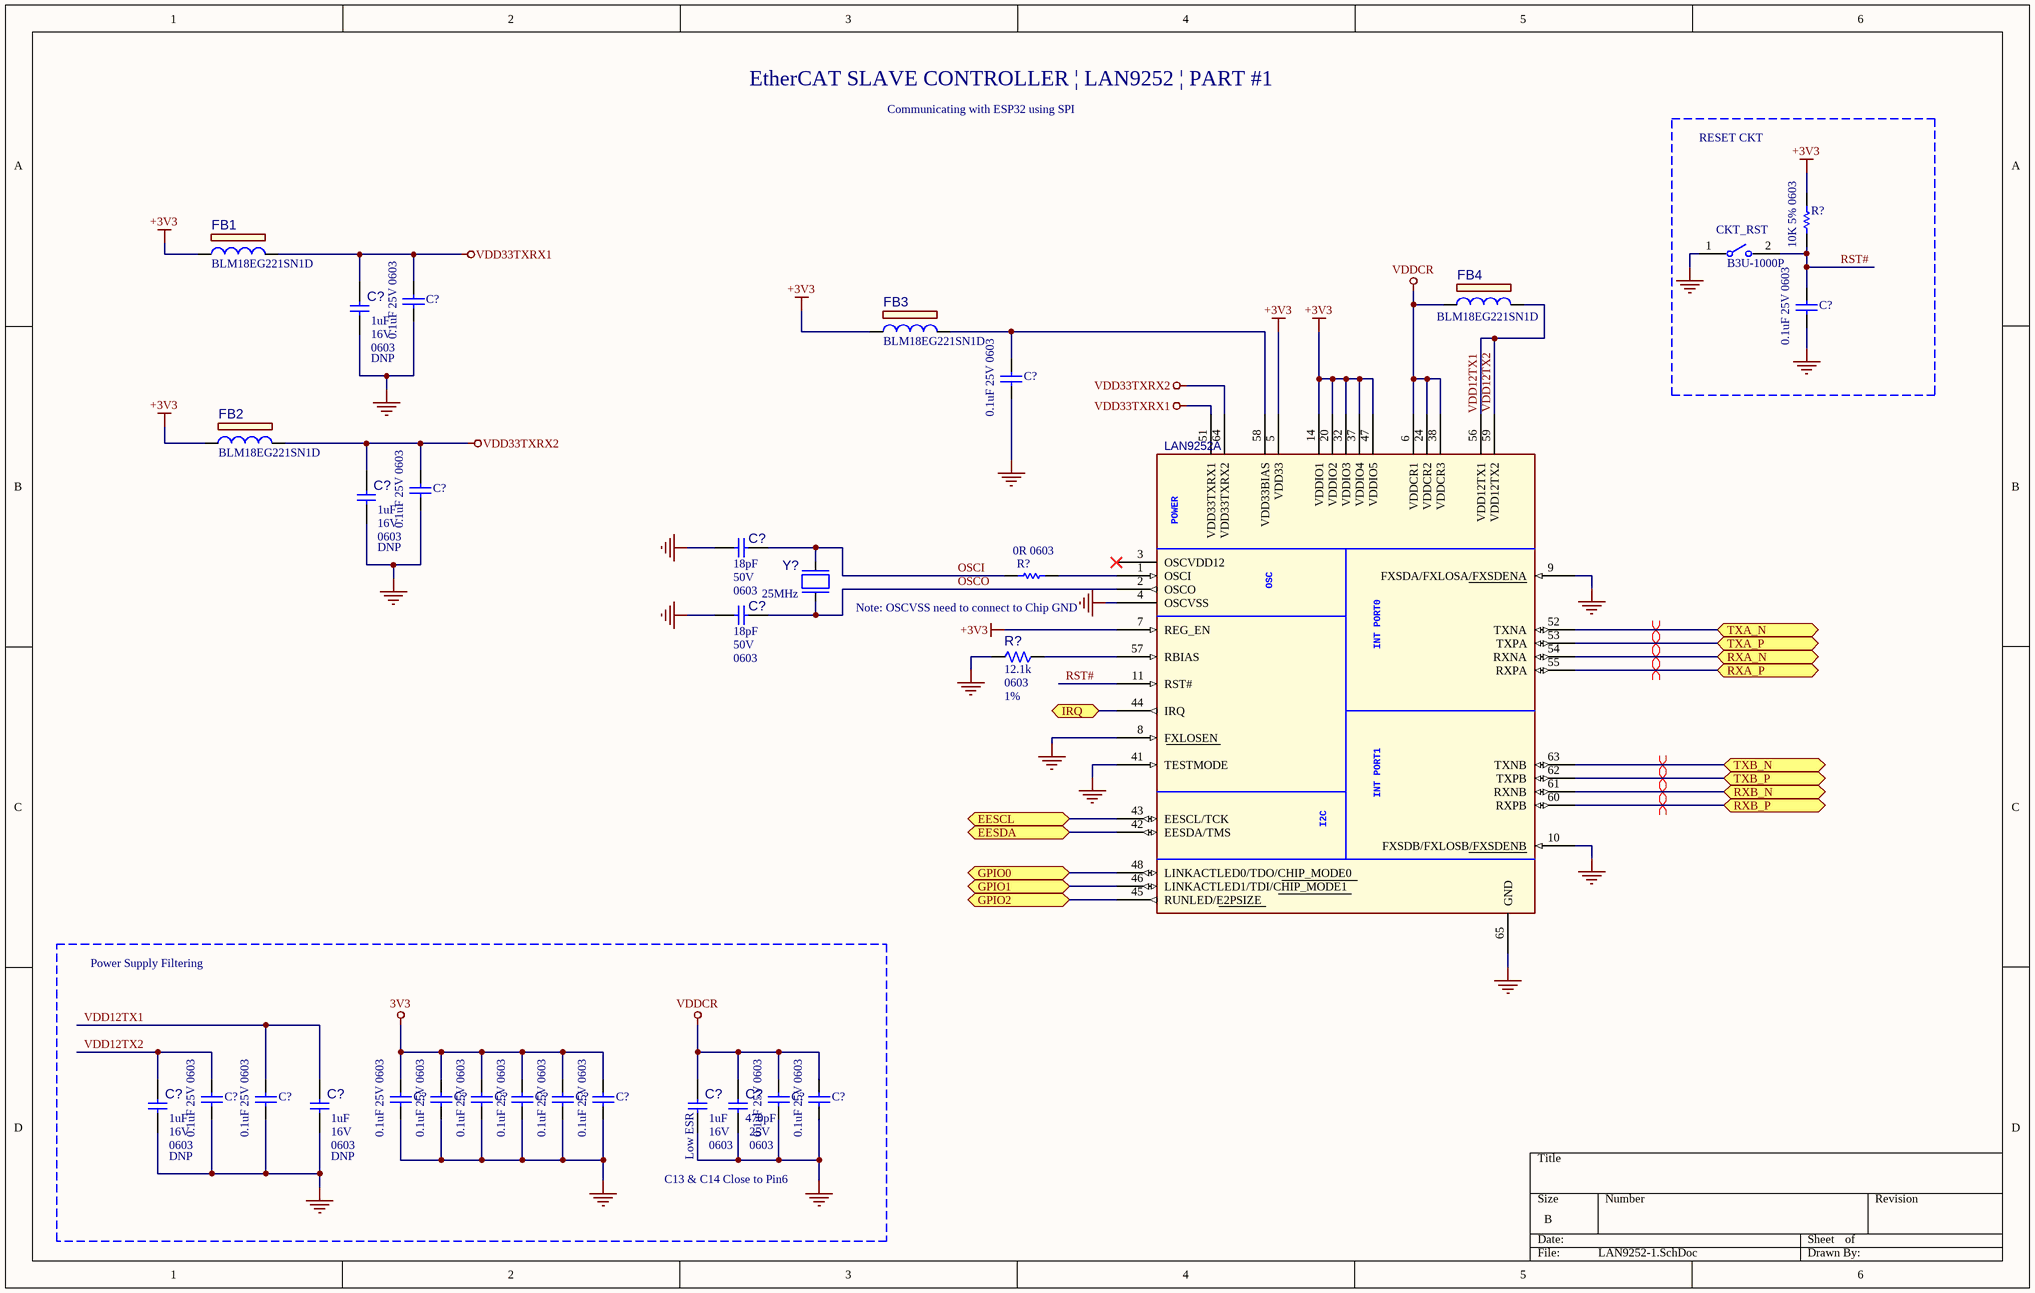
[diagram p3: LAN9252-1.SchDoc]

### Parts
(Parts that share a designator on the sheet are numbered #1, #2 ... from top to bottom, then left to right.)
C?#1  0.1uF 25V 0603  [CAPC1608X90X35LL10T15]
C?#2  0.1uF 25V 0603  [CAPC1608X90X35LL10T15]
C?#3  value 1uF  Voltage: 16V  Package: 0603  Populated: DNP  [CAP_C_0603]  (hidden comment: Capacitor NP)
C?#4  0.1uF 25V 0603  [CAPC1608X90X35LL10T15]
C?#5  0.1uF 25V 0603  [CAPC1608X90X35LL10T15]
C?#6  value 1uF  Voltage: 16V  Package: 0603  Populated: DNP  [CAP_C_0603]  (hidden comment: Capacitor NP)
C?#7  value 18pF  Voltage: 50V  Package: 0603  [CAP_C_0603]  (hidden comment: Capacitor NP)
C?#8  value 18pF  Voltage: 50V  Package: 0603  [CAP_C_0603]  (hidden comment: Capacitor NP)
C?#9  0.1uF 25V 0603  [CAPC1608X90X35LL10T15]
C?#10  0.1uF 25V 0603  [CAPC1608X90X35LL10T15]
C?#11  0.1uF 25V 0603  [CAPC1608X90X35LL10T15]
C?#12  0.1uF 25V 0603  [CAPC1608X90X35LL10T15]
C?#13  0.1uF 25V 0603  [CAPC1608X90X35LL10T15]
C?#14  0.1uF 25V 0603  [CAPC1608X90X35LL10T15]
C?#15  0.1uF 25V 0603  [CAPC1608X90X35LL10T15]
C?#16  0.1uF 25V 0603  [CAPC1608X90X35LL10T15]
C?#17  0.1uF 25V 0603  [CAPC1608X90X35LL10T15]
C?#18  0.1uF 25V 0603  [CAPC1608X90X35LL10T15]
C?#19  value 1uF  Voltage: 16V  Package: 0603  Populated: DNP  [CAP_C_0603]  (hidden comment: Capacitor NP)
C?#20  value 1uF  Voltage: 16V  Package: 0603  Populated: DNP  [CAP_C_0603]  (hidden comment: Capacitor NP)
C?#21  value 1uF  Voltage: 16V  Package: 0603  [CAP_C_0603]  (hidden comment: Capacitor NP)
C?#22  value 470pF  Voltage: 25V  Package: 0603  [CAP_C_0603]  (hidden comment: Capacitor NP)
CKT_RST  B3U-1000P  [FP-B3U-1000P-MFG]
FB1  value BLM18EG221SN1D  [SMD_0603]  (hidden comment: FERRITE BLM18EG221SN1D)
FB2  value BLM18EG221SN1D  [SMD_0603]  (hidden comment: FERRITE BLM18EG221SN1D)
FB3  value BLM18EG221SN1D  [SMD_0603]  (hidden comment: FERRITE BLM18EG221SN1D)
FB4  value BLM18EG221SN1D  [SMD_0603]  (hidden comment: FERRITE BLM18EG221SN1D)
LAN9252  (no value)  [QFN-64_9x9_EP6SQ]  (part A of 2)
R?#1  10K 5% 0603  [RESC1608X55X25ML10T15]
R?#2  0R 0603  [RESC1608X55X25ML10T15]
R?#3  value 12.1k  Package: 0603  Tolerance: 1%  [RES_C_0603]  (hidden comment: Resistor)
Y?  Frequency: 25MHz  [CRYSTAL_HC49-SMD-B]  (hidden comment: XTAL 25MHz HC49/US)

### Blocks framed on the sheet
RESET CKT: C?#2 CKT_RST R?#1

### Ports
EESCL (bidir), EESDA (bidir), GPIO0 (bidir), GPIO1 (bidir), GPIO2 (bidir), IRQ (bidir), RXA_N (bidir), RXA_P (bidir), RXB_N (bidir), RXB_P (bidir), TXA_N (bidir), TXA_P (bidir), TXB_N (bidir), TXB_P (bidir)

### Nets
3V3: C?#11.2 C?#12.2 C?#13.2 C?#14.2 C?#15.2 C?#16.2
+3V3: FB1.1 FB2.1 FB3.1 LAN9252.5(VDD33) LAN9252.7(REG_EN) LAN9252.14(VDDIO1) LAN9252.20(VDDIO2) LAN9252.32(VDDIO3) LAN9252.37(VDDIO4) LAN9252.47(VDDIO5) R?#1.2
GND: C?#1.1 C?#2.1 C?#3.1 C?#4.1 C?#5.1 C?#6.1 C?#7.1 C?#8.1 C?#9.1 C?#10.1 C?#11.1 C?#12.1 C?#13.1 C?#14.1 C?#15.1 C?#16.1 C?#17.1 C?#18.1 C?#19.1 C?#20.1 C?#21.1 C?#22.1 CKT_RST.1 LAN9252.4(OSCVSS) LAN9252.8(FXLOSEN) LAN9252.9(FXSDA/FXLOSA/FXSDENA) LAN9252.10(FXSDB/FXLOSB/FXSDENB) LAN9252.41(TESTMODE) LAN9252.65(GND) R?#3.1
VDD33TXRX1: C?#1.2 C?#3.2 FB1.2 LAN9252.51(VDD33TXRX1)
VDD33TXRX2: C?#5.2 C?#6.2 FB2.2 LAN9252.64(VDD33TXRX2)
VDDCR: C?#17.2 C?#18.2 C?#21.2 C?#22.2 FB4.1 LAN9252.6(VDDCR1) LAN9252.24(VDDCR2) LAN9252.38(VDDCR3)
GPIO0: LAN9252.48(LINKACTLED0/TDO/CHIP_MODE0) ; port GPIO0
GPIO1: LAN9252.46(LINKACTLED1/TDI/CHIP_MODE1) ; port GPIO1
IRQ: LAN9252.44(IRQ) ; port IRQ
OSCI: C?#7.2 R?#2.1 Y?.2(Osc2)
OSCO: C?#8.2 LAN9252.2(OSCO) Y?.1(Osc1)
RST#: C?#2.2 CKT_RST.2 LAN9252.11(RST#) R?#1.1
VDD12TX1: C?#9.2 C?#10.2 C?#19.2 C?#20.2 FB4.2 LAN9252.56(VDD12TX1) LAN9252.59(VDD12TX2)  [also labelled VDD12TX2]
NetC?#4_2: C?#4.2 FB3.2 LAN9252.58(VDD33BIAS)
NetC?#23_2: LAN9252.53(TXPA) ; port TXA_P
NetC?#24_2: LAN9252.52(TXNA) ; port TXA_N
NetC?#25_2: LAN9252.55(RXPA) ; port RXA_P
NetC?#26_2: LAN9252.54(RXNA) ; port RXA_N
NetC?#29_2: LAN9252.62(TXPB) ; port TXB_P
NetC?#30_2: LAN9252.63(TXNB) ; port TXB_N
NetC?#31_2: LAN9252.60(RXPB) ; port RXB_P
NetC?#32_2: LAN9252.61(RXNB) ; port RXB_N
NetEtherCAT_EEPROM_5: LAN9252.42(EESDA/TMS) ; port EESDA
NetEtherCAT_EEPROM_6: LAN9252.43(EESCL/TCK) ; port EESCL
NetLAN9252_1: LAN9252.1(OSCI) R?#2.2
NetLAN9252_45: LAN9252.45(RUNLED/E2PSIZE) ; port GPIO2
NetLAN9252_57: LAN9252.57(RBIAS) R?#3.2

Not connected (* = marked no-connect by the designer): LAN9252 3(OSCVDD12)*

### Layout directives
differential pair: NetC?#23_2, NetC?#24_2, NetC?#25_2, NetC?#26_2, NetC?#29_2, NetC?#30_2, NetC?#31_2, NetC?#32_2

### Notes on the sheet
- EtherCAT SLAVE CONTROLLER | LAN9252 | PART #1
- Communicating with ESP32 using SPI
- Note: OSCVSS need to connect to Chip GND
- Power Supply Filtering
- (near C?#21) Low ESR
- C13 & C14 Close to Pin6
- (in symbol LAN9252_QFN64, part A) POWER; OSC; INT PORT0; INT PORT1; I2C

### Library data of the parts
C?#1 C?#2 C?#4 C?#5 C?#9-C?#18 = CMP-2006-02868-1: as C2 on sheet USB-ESP32
C?#3 C?#6 C?#19 C?#20 = CAP0265: Capacitor; Manufacturer 1: AVX; Manufacturer Part Number 1: 0603YD105KAT2A; Description_: CAP CER 1uF 16V 10% X5R SMD 0603; Tolerance: 10%; Temperature Coeffcient: X5R; Type: Ceramic; MCHP-ID: CAP0265; Revision: 1; Status: Production; ComponentLink1URL: https://chn-vm-apps.microchip.com/mchprepo/parts/Datasheets/smccp.pdf; ComponentLink1Description: Datasheet; Operating Temperature: -55C to +85C; Category: Capacitor; Manufacturer 2: Murata; Manufacturer Part Number 2: GRM188R61C105KA93D; Manufacturer 3: Murata; Manufacturer Part Number 3: GRM185R61C105KE44D; Manufacturer 4: Panasonic; Manufacturer Part Number 4: ECJ-1VB1C105K; Manufacturer 5: Taiyo Yuden; Manufacturer Part Number 5: EMK107BJ105KA-T; Manufacturer 6: TDK; Manufacturer Part Number 6: C1608X5R1C105K; Supplier 1: Digi-Key; Supplier Part Number 1: 478-1249-1-ND; Supplier 2: Digi-Key; Supplier Part Number 2: 490-1536-1-ND; Supplier 3: Digi-Key; Supplier Part Number 3: 490-3894-1-ND; Supplier 4: Digi-Key; Supplier Part Number 4: PCC2224CT-ND; Supplier 5: Digi-Key; Supplier Part Number 5: 587-1251-1-ND; Supplier 6: Digi-Key; Supplier Part Number 6: 445-1416-1-ND; Quantity Override: 1
C?#7 C?#8 = CAP0063: Capacitor; Manufacturer 1: KEMET; Manufacturer Part Number 1: C0603C180J5GACTU; Description_: CAP CER 18pF 50V 5% NP0 SMD 0603; Tolerance: 5%; Temperature Coeffcient: NP0; Type: Ceramic; Populated: Yes; MCHP-ID: CAP0063; Revision: 1; Status: Production; ComponentLink1URL: https://chn-vm-apps.microchip.com/mchprepo/parts/Datasheets/ECJ__General_.pdf; ComponentLink1Description: Datasheet; Operating Temperature: -55C to +125C; Category: Capacitor; Manufacturer 2: TDK; Manufacturer Part Number 2: C1608C0G1H180J; Manufacturer 3: Murata; Manufacturer Part Number 3: GRM1885C1H180JA01D; Manufacturer 4: Panasonic; Manufacturer Part Number 4: ECJ-1VC1H180J; Supplier 1: Digi-Key; Supplier Part Number 1: 399-1052-1-ND; Supplier 2: Digi-Key; Supplier Part Number 2: 445-1272-1-ND; Supplier 3: Digi-Key; Supplier Part Number 3: 490-1409-1-ND; Supplier 4: Digi-Key; Supplier Part Number 4: PCC180ACVCT-ND; Quantity Override: 1
C?#21 = CAP0265: Capacitor; Manufacturer 1: AVX; Manufacturer Part Number 1: 0603YD105KAT2A; Description_: CAP CER 1uF 16V 10% X5R SMD 0603; Tolerance: 10%; Temperature Coeffcient: X5R; Type: Ceramic; Populated: Yes; MCHP-ID: CAP0265; Revision: 1; Status: Production; ComponentLink1URL: https://chn-vm-apps.microchip.com/mchprepo/parts/Datasheets/smccp.pdf; ComponentLink1Description: Datasheet; Operating Temperature: -55C to +85C; Category: Capacitor; Manufacturer 2: Murata; Manufacturer Part Number 2: GRM188R61C105KA93D; Manufacturer 3: Murata; Manufacturer Part Number 3: GRM185R61C105KE44D; Manufacturer 4: Panasonic; Manufacturer Part Number 4: ECJ-1VB1C105K; Manufacturer 5: Taiyo Yuden; Manufacturer Part Number 5: EMK107BJ105KA-T; Manufacturer 6: TDK; Manufacturer Part Number 6: C1608X5R1C105K; Supplier 1: Digi-Key; Supplier Part Number 1: 478-1249-1-ND; Supplier 2: Digi-Key; Supplier Part Number 2: 490-1536-1-ND; Supplier 3: Digi-Key; Supplier Part Number 3: 490-3894-1-ND; Supplier 4: Digi-Key; Supplier Part Number 4: PCC2224CT-ND; Supplier 5: Digi-Key; Supplier Part Number 5: 587-1251-1-ND; Supplier 6: Digi-Key; Supplier Part Number 6: 445-1416-1-ND; Quantity Override: 1
C?#22 = CAP0603: Capacitor; Manufacturer 1: AVX; Manufacturer Part Number 1: 06033A471JAT2A; Description_: CAP CER 470pF 25V 5% NP0 SMD 0603; Tolerance: 5%; Temperature Coeffcient: NP0; Type: Ceramic; Populated: Yes; MCHP-ID: CAP0603; Revision: 1; Status: Production; ComponentLink1URL: https://chn-vm-apps.microchip.com/mchprepo/parts/Datasheets/smccp.pdf; ComponentLink1Description: Datasheet; Operating Temperature: -55C to +125C; Category: Capacitor; Supplier 1: Digi-Key; Supplier Part Number 1: 478-6201-1-ND; Quantity Override: 1
CKT_RST = CMP-2100-03586-2: as ESP32_BOOT on sheet ESP32; Height: 1.2mm; Width: 3mm; Weight: 0.000776oz; Contact Material: Silver; Max Voltage Rating (DC): 12V; Insulation Resistance: 100MR; Lead Free: Lead Free; Current Rating: 50mA; Termination: SMD/SMT; Length: 4mm; Voltage Rating (DC): 12V; Contact Current Rating: 50mA; Orientation: Straight; Depth: 2.5mm; Max Operating Temperature: 70°C; Packaging: Tape and Reel; Min Operating Temperature: -25°C; Package Quantity: 1; Mount: Surface Mount; Electrical Life: 200000Cycles
FB1-FB4 = FERRITE BLM18EG221SN1D: FERRITE BEAD 2A 220OHM 0603; Manufacturer 1: Murata Electronics North America; Owner: Manikandan; DCR: 50ohm; Populated: YES; Symbol: Ferrite Bead; Description_: FERRITE BEAD 2A 220OHM 0603; ComponentLink1URL: http://search.murata.co.jp/Ceramy/image/img/PDF/ENG/L0110S0101BLM18E.pdf; ComponentLink1Description: Datasheet; Operating Temperature: -55C to +125C; Package: 0603; Type: Ferrite Bead; Category: Ferrite Bead; Manufacturer Part Number 1: BLM18EG221SN1D; Supplier 1: Digi-Key; Supplier Part Number 1: 490-3992-1-ND; Quantity Override: 1
LAN9252 = LAN9252_QFN64: IC, 2/3-Port EtherCAT® Slave Controller, QFN64; Manufacturer Part Number 1: LAN9252x/ML; Manufacturer 1: Microchip; Populated: Yes; Owner: Manikandan; Supplier Part Number 1: LAN9252I/ML-ND; Supplier 1: Digikey; Description_: IC, 2/3-Port EtherCAT® Slave Controller, QFN64; RoHS: Yes; Package: QFN64-9X9x1; Document Link: http://ww1.microchip.com/downloads/en/DeviceDoc/00001909A.pdf; Status: New
R?#1 = CMP-2100-03664-1: as R1 on sheet USB-ESP32; Composition: ThickFilm; RoHSCompliant: true; Height: 0.45mm; Lead Free: LeadFree; Case Code (Metric): 1608; Case/Package: 0603; Datasheet Version: Rev. 5, 10/2016; Package Reference: 0603; Depth: 0.8mm; Package Description: 2-Pin Surface Mount Device, Body 1.6 x 0.8 mm; Case Code (Imperial): 0603; Packaging: TapeandReel; Termination: SMD/SMT; Lead Pitch: 0.3mm; Width: 0.8mm; Number of Pins: 2; Length: 1.6mm; REACH SVHC: NoSVHC; Military Standard: Not; Max Operating Temperature: 155degC; Min Operating Temperature: -55degC; Manufacturer URL: http://www.yageo.com/; Datasheet URL: http://www.yageo.com/NewPortal/yageodocoutput?fileName=/pdf/R-Chip/PYu-RC_Group_51_RoHS_L_5.pdf; Weight: 7.1E-05oz; Tolerance: 1%
R?#2 = CMP-2100-03667-1: as R5 on sheet USB-ESP32; Width: 0.8mm; Max Operating Temperature: 155degC; Tolerance: 5%; Package Reference: 0603; Height: 0.45mm; Depth: 0.8mm; Package Description: 2-Pin Surface Mount Device, Body 1.6 x 0.8 mm; Termination: SMD/SMT; Package Quantity: 5000; Case/Package: 0603; Case Code (Imperial): 0603; Radiation Hardening: No; Number of Pins: 2; Length: 1.6mm; Lead Free: LeadFree; Voltage Rating (DC): 50V; Military Standard: Not; Datasheet URL: http://www.yageo.com/NewPortal/yageodocoutput?fileName=/pdf/R-Chip/PYu-RC_Group_51_RoHS_L_5.pdf; Manufacturer URL: http://www.yageo.com/; Packaging: TapeandReel; Case Code (Metric): 1608; Min Operating Temperature: -55degC; Composition: ThickFilm; RoHSCompliant: true; Contact Plating: Tin; Datasheet Version: Rev. 5, 10/2016; REACH SVHC: NoSVHC
R?#3 = RSMT0414: Manufacturer 1: Panasonic; Manufacturer Part Number 1: ERJ-3EKF1212V; Description_: RES TKF 12.1k 1% 1/10W SMD 0603; Voltage: 75V; Temperature Coeffcient: 100ppm/C; Power: 1/10W; Populated: Yes; MCHP-ID: RSMT0414; Revision: 1; Status: Production; ComponentLink1URL: https://chn-vm-apps.microchip.com/mchprepo/parts/Datasheets/AOA0000CE2.pdf; ComponentLink1Description: Datasheet; Operating Temperature: -55C to +155C; Category: Resistor; Type: RES SMD; Composition: TKF; Manufacturer 2: ROHM; Manufacturer Part Number 2: MCR03EZPFX1212; Manufacturer 3: SET; Manufacturer Part Number 3: RMCF1/1612.1K1%TR; Supplier 1: Digi-Key; Supplier Part Number 1: P12.1KHCT-ND; Supplier 2: Digi-Key; Supplier Part Number 2: RHM12.1KHCT-ND; Supplier 3: SET; Supplier Part Number 3: RMCF1/1612.1K1%TR; Quantity Override: 1
Y? = XTAL 25MHz HC49US: Crystal 25MHz HC49/US; Manufacturer: Murata Electronics North America; Frequency Stability: ±30ppm; Load Capacitance: 6pF; Operating Mode: Fundamental; Revision: A; Supplier 1: Mouser; RoHS: RoHS Compliant; Category: Crystals and Oscillators; Stock 1: 4385; Pricing 1: 1=0.52, 10=0.434, 50=0.3894, 100=0.3465, 500=0.33, 1000=0.2772 (USD); Packaging: Cut Tape (CT); Type: MHz Crystal; Frequency Tolerance: ±30ppm; Operating Temperature: -30°C ~ 85°C; Ratings: -; Mounting Type: Surface Mount; Package / Case: HC49/US

## Sheet LAN9252-2.SchDoc
size B
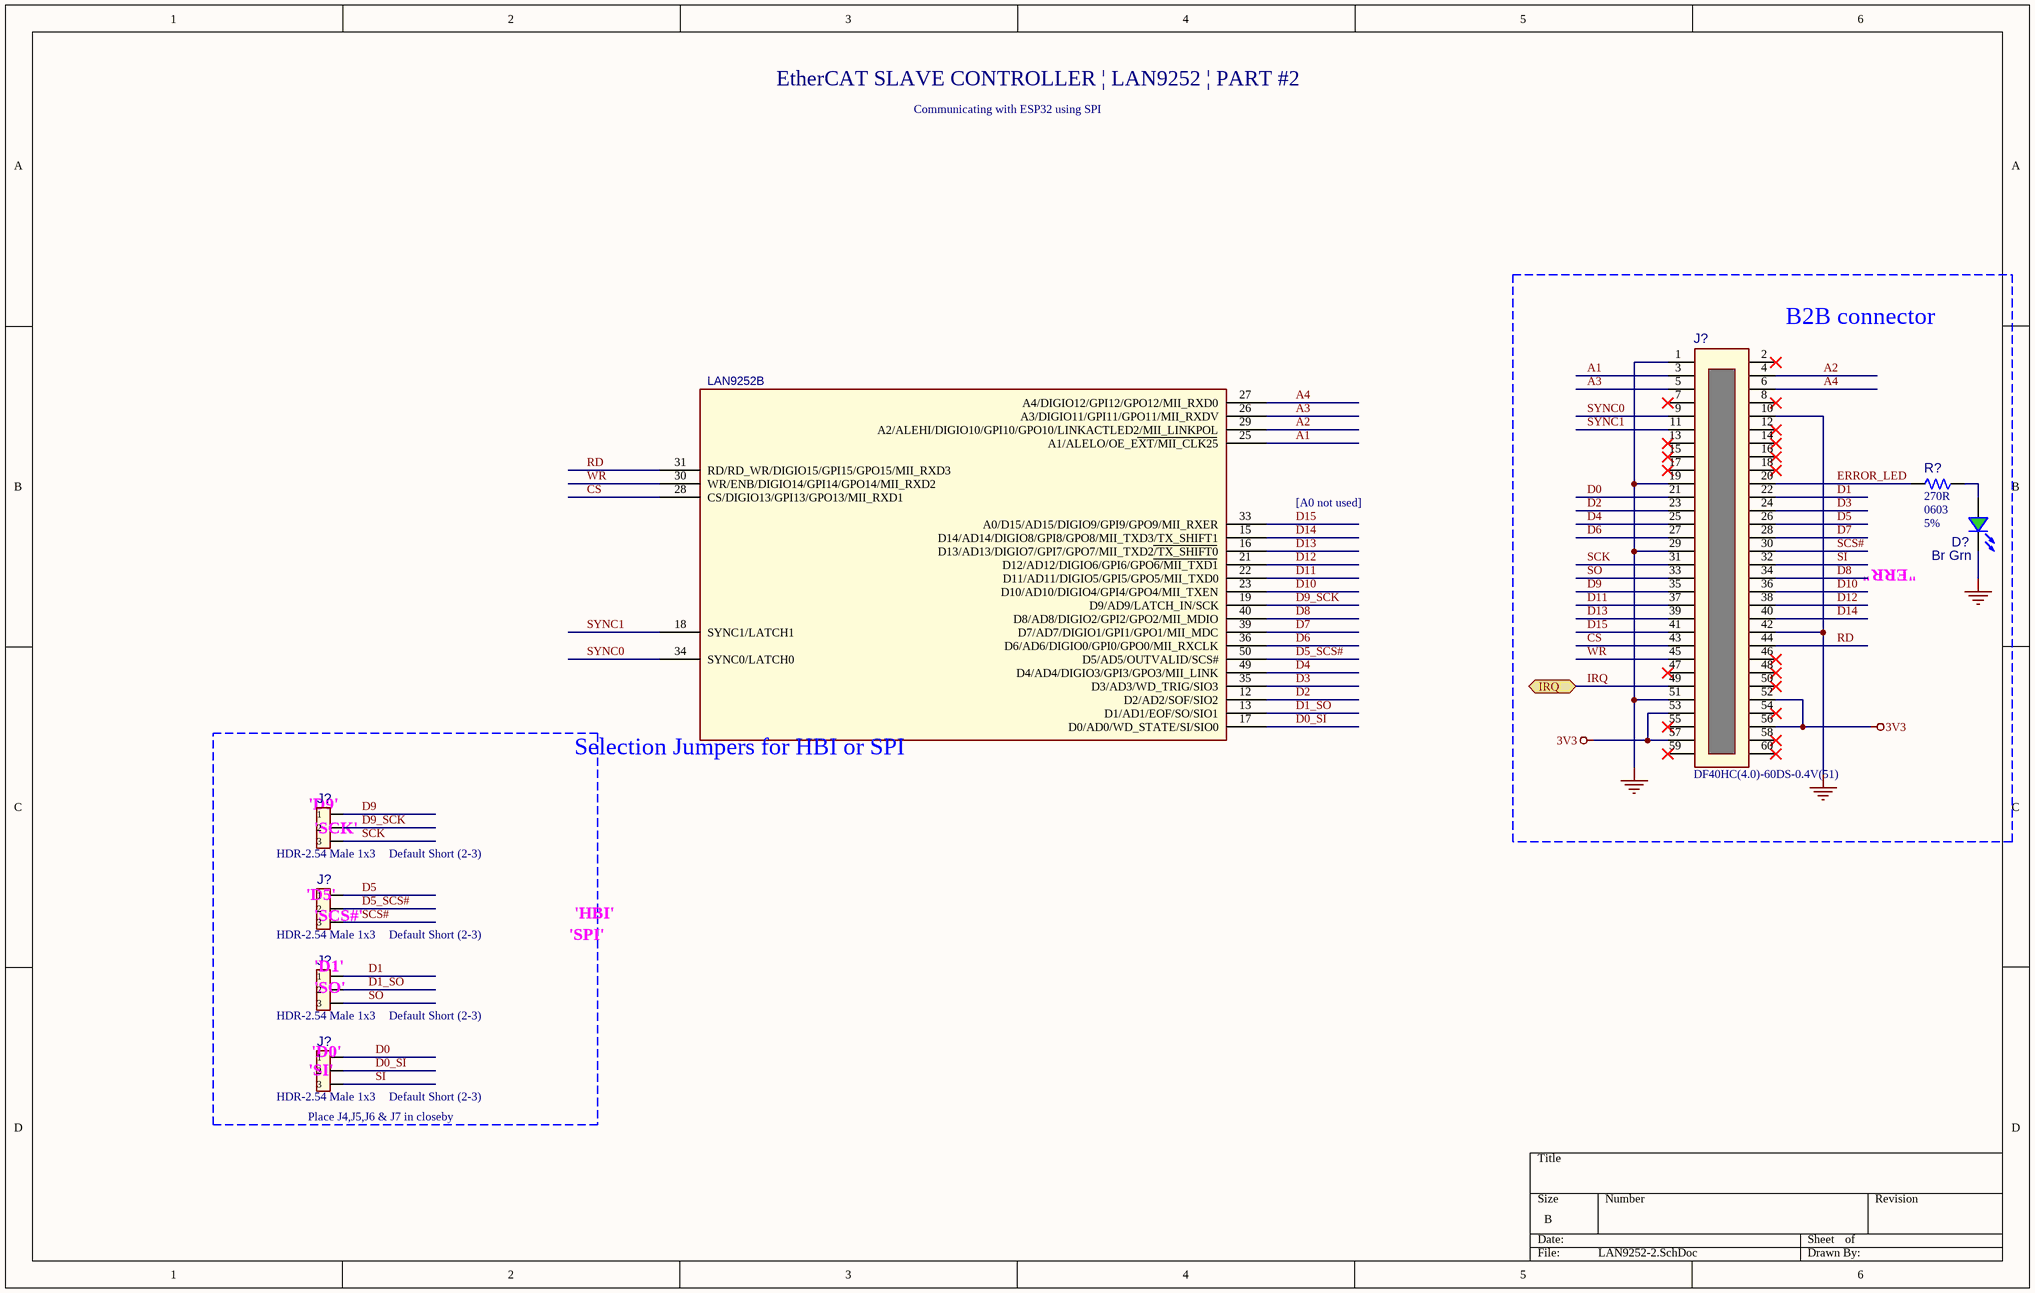
[diagram p4: LAN9252-2.SchDoc]

### Parts
(Parts that share a designator on the sheet are numbered #1, #2 ... from top to bottom, then left to right.)
D?  value Br Grn  [LED_0603_GREEN]  (hidden comment: LED, Bright Green, 0603)
J?#1  value DF40HC(4.0)-60DS-0.4V(51)  [CONN_DF40HC(4.0)-60DS-0.4V(51)]  (hidden comment: CONN DF40)
J?#2  value HDR-2.54 Male 1x3  [HDR_M_2.54_1x3]  (hidden comment: Header 1x3)
J?#3  value HDR-2.54 Male 1x3  [HDR_M_2.54_1x3]  (hidden comment: Header 1x3)
J?#4  value HDR-2.54 Male 1x3  [HDR_M_2.54_1x3]  (hidden comment: Header 1x3)
J?#5  value HDR-2.54 Male 1x3  [HDR_M_2.54_1x3]  (hidden comment: Header 1x3)
LAN9252  (no value)  [QFN-64_9x9_EP6SQ]  (part B of 2)
R?#4  value 270R  Package: 0603  Tolerance: 5%  [RES_C_0603]  (hidden comment: Resistor)

### Blocks framed on the sheet
B2B connector: D? J?#1 R?#4
Selection Jumpers for HBI or SPI: J?#2-J?#5

### Ports
IRQ (bidir)

### Nets
3V3: J?#1.52(P52) J?#1.53(P53) J?#1.56(P56) J?#1.57(P57)
GND: D?.2(K) J?#1.1(P1) J?#1.10(P10) J?#1.19(P19) J?#1.29(P29) J?#1.42(P42) J?#1.51(P51)
A1: J?#1.3(P3) LAN9252.25(A1/ALELO/OE_EXT/MII_CLK25)
A2: J?#1.4(P4) LAN9252.29(A2/ALEHI/DIGIO10/GPI10/GPO10/LINKACTLED2/MII_LINKPOL)
A3: J?#1.5(P5) LAN9252.26(A3/DIGIO11/GPI11/GPO11/MII_RXDV)
A4: J?#1.6(P6) LAN9252.27(A4/DIGIO12/GPI12/GPO12/MII_RXD0)
CS: J?#1.43(P43) LAN9252.28(CS/DIGIO13/GPI13/GPO13/MII_RXD1)
D0: J?#1.21(P21) J?#5.1
D0_SI: J?#5.2 LAN9252.17(D0/AD0/WD_STATE/SI/SIO0)
D1: J?#1.22(P22) J?#4.1
D1_SO: J?#4.2 LAN9252.13(D1/AD1/EOF/SO/SIO1)
D2: J?#1.23(P23) LAN9252.12(D2/AD2/SOF/SIO2)
D3: J?#1.24(P24) LAN9252.35(D3/AD3/WD_TRIG/SIO3)
D4: J?#1.25(P25) LAN9252.49(D4/AD4/DIGIO3/GPI3/GPO3/MII_LINK)
D5: J?#1.26(P26) J?#3.1
D5_SCS#: J?#3.2 LAN9252.50(D5/AD5/OUTVALID/SCS#)
D6: J?#1.27(P27) LAN9252.36(D6/AD6/DIGIO0/GPI0/GPO0/MII_RXCLK)
D7: J?#1.28(P28) LAN9252.39(D7/AD7/DIGIO1/GPI1/GPO1/MII_MDC)
D8: J?#1.34(P34) LAN9252.40(D8/AD8/DIGIO2/GPI2/GPO2/MII_MDIO)
D9: J?#1.35(P35) J?#2.1
D9_SCK: J?#2.2 LAN9252.19(D9/AD9/LATCH_IN/SCK)
D10: J?#1.36(P36) LAN9252.23(D10/AD10/DIGIO4/GPI4/GPO4/MII_TXEN)
D11: J?#1.37(P37) LAN9252.22(D11/AD11/DIGIO5/GPI5/GPO5/MII_TXD0)
D12: J?#1.38(P38) LAN9252.21(D12/AD12/DIGIO6/GPI6/GPO6/MII_TXD1)
D13: J?#1.39(P39) LAN9252.16(D13/AD13/DIGIO7/GPI7/GPO7/MII_TXD2/TX_SHIFT0)
D14: J?#1.40(P40) LAN9252.15(D14/AD14/DIGIO8/GPI8/GPO8/MII_TXD3/TX_SHIFT1)
D15: J?#1.41(P41) LAN9252.33(A0/D15/AD15/DIGIO9/GPI9/GPO9/MII_RXER)
ERROR_LED: J?#1.20(P20) R?#4.2
IRQ: J?#1.49(P49) ; port IRQ
RD: J?#1.44(P44) LAN9252.31(RD/RD_WR/DIGIO15/GPI15/GPO15/MII_RXD3)
SCK: J?#1.31(P31) J?#2.3
SCS#: J?#1.30(P30) J?#3.3
SI: J?#1.32(P32) J?#5.3
SO: J?#1.33(P33) J?#4.3
SYNC0: J?#1.9(P9) LAN9252.34(SYNC0/LATCH0)
SYNC1: J?#1.11(P11) LAN9252.18(SYNC1/LATCH1)
WR: J?#1.45(P45) LAN9252.30(WR/ENB/DIGIO14/GPI14/GPO14/MII_RXD2)
NetD?_1: D?.1(A) R?#4.1

Not connected (* = marked no-connect by the designer): J?#1 2(P2)* 7(P7)* 8(P8)* 12(P12)* 13(P13)* 14(P14)* 15(P15)* 16(P16)* 17(P17)* 18(P18)* 46(P46)* 47(P47)* 48(P48)* 50(P50)* 54(P54)* 55(P55)* 58(P58)* 59(P59)* 60(P60)*

### Notes on the sheet
- EtherCAT SLAVE CONTROLLER | LAN9252 | PART #2
- Communicating with ESP32 using SPI
- [A0 not used]
- (near D?) "ERR"
- (near J?#2) 'D9'
- (near J?#2) 'SCK'
- (near J?#3) 'D5'
- Default Short (2-3)
- (near J?#3) 'SCS#'
- (near J?#4) 'D1'
- 'SPI'
- 'HBI'
- (near J?#4) 'SO'
- (near J?#5) 'SI'
- (near J?#5) 'D0'
- (near J?#5) Place J4,J5,J6 & J7 in closeby

### Library data of the parts
D? = LED, Bright Green, 0603: Manufacturer 1: Lite-On; Manufacturer Part Number 1: LTST-C191KGKT; Type: LED Single; Forward Current: 20mA; MCD: 35mcd; Owner: Jennifer Hancock; Viewing Angle: 130°; Revision: -; Description_: LED, Bright Green, 0603; Package: 0603 (1608 Metric); ComponentLink1URL: http://optoelectronics.liteon.com/upload/download/DS22-2000-228/S_110_LTST-C191KGKT.pdf; ComponentLink1Description: Datasheet; Category: Diode; Mounting Type: Surface Mount; Supplier 1: Digi-Key; Supplier Part Number 1: 160-1446-6-ND
J?#1 = CONN RCPT 60P 4MM DF40 HRS: Manufacturer 1: Hirose Electric Co Ltd; Owner: Manikandan; Populated: YES; Description_: CONN RCPT 60P 4MM DF40 HRS; ComponentLink1URL: http://nyusperforce.smsc.com//depot_np_hweng_boards/altium_libraries/datasheets/Hirose\DF40HC(4.0)-60DS-0.4V(51).pdf; ComponentLink1Description: Datasheet; Package: 60pin 2 Row; Type: Connector; Category: Interconnects; Manufacturer Part Number 1: DF40HC(4.0)-60DS-0.4V(51); Supplier 1: Digi-Key; Supplier Part Number 1: H11918CT-ND
J?#2-J?#5 = CON0465: Manufacturer 1: Samtec; Manufacturer Part Number 1: TSW-103-07-T-S; Description_: CON HDR-2.54 Male 1x3 Tin 5.84MH TH VERT; Populated: Yes; MCHP-ID: CON0465; Revision: 1; Status: Production; ComponentLink1URL: https://chn-vm-apps.microchip.com/mchprepo/parts/Datasheets/TSW-XXX-XX-XXX-X-XX-XXX-MKT.pdf; ComponentLink1Description: Datasheet; Type: Header 2.54mm; Category: Connector; Supplier 1: Digi-Key; Supplier Part Number 1: SAM1035-03-ND; Quantity Override: 1
LAN9252 = LAN9252_QFN64: as LAN9252 on sheet LAN9252-1; Supplier Part Number 1: LAN9252I/ML-ND; Supplier 1: Digikey; Description_: IC, 2/3-Port EtherCAT® Slave Controller, QFN64; RoHS: Yes; Package: QFN64-9X9x1; Document Link: http://ww1.microchip.com/downloads/en/DeviceDoc/00001909A.pdf; Status: New
R?#4 = RES1150: Manufacturer 1: Panasonic; Manufacturer Part Number 1: ERJ-3GEYJ271V; Description_: RES TKF 270R 5% 1/10W SMD 0603; Dev Tools Status: Production; Voltage: 75V; Temperature Coeffcient: 200ppm/C; Power: 1/10W; Owner: Bogdan P (M91398); Populated: Yes; MCHP-ID: RES1150; Revision: 0; Status: MCL Design; ComponentLink1URL: https://chn-vm-apps.microchip.com/mchprepo/parts/Datasheets/AOA0000CE1.pdf; ComponentLink1Description: Datasheet; Operating Temperature: -55C to +155C; Category: Resistor; Type: RES SMD; Composition: TKF; Supplier 1: Digi-Key; Supplier Part Number 1: P270GCT-ND; Quantity Override: 1